# EAGLE schematic cudrone-board-mk-2 (EAGLE 8.2.2)

## Sheet 1 of 9
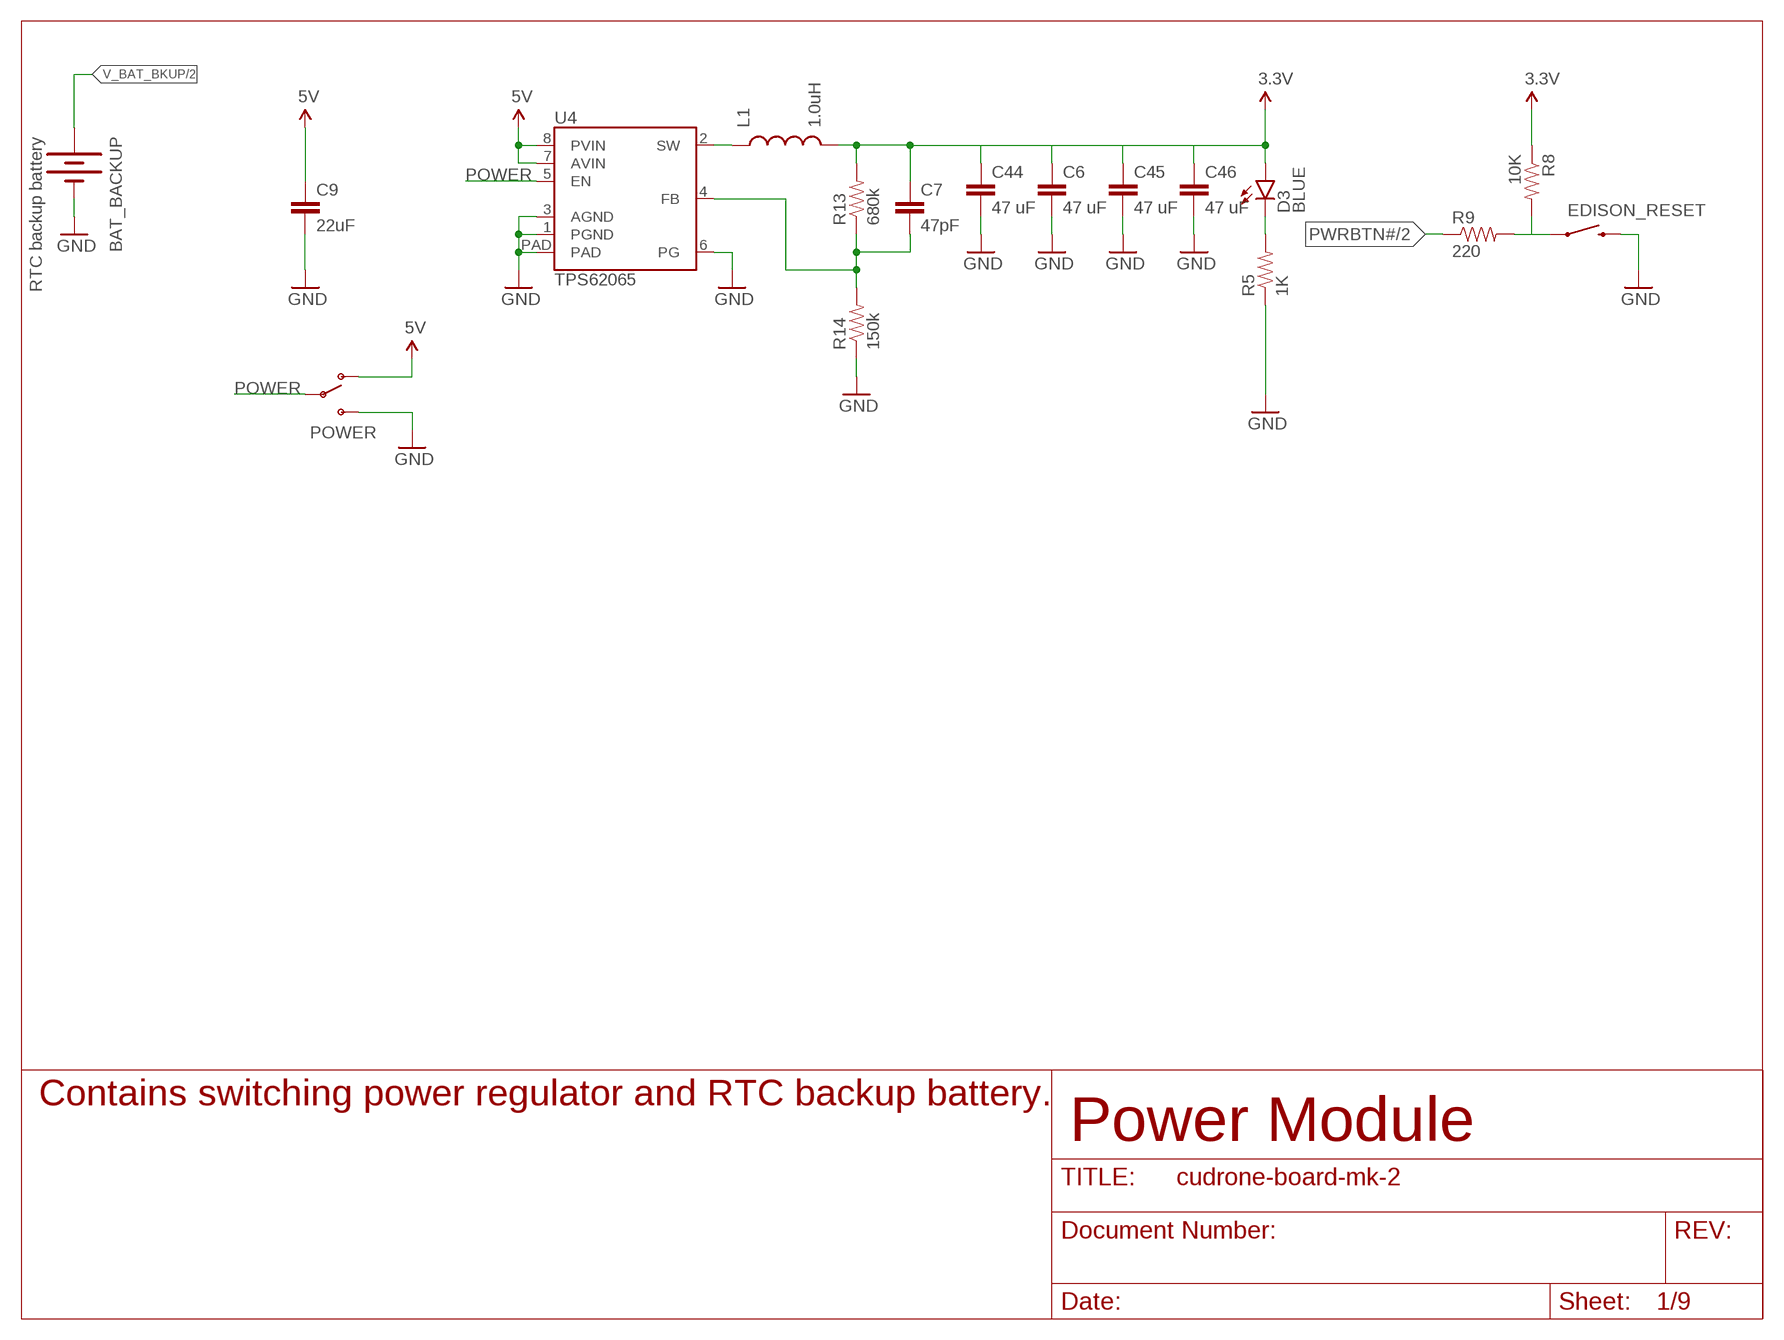
[diagram p0: schematic, sheet 1]

### Parts
BAT_BACKUP  RTC backup battery  BATTERY12MM  [BATTCON_12MM]
C6  47 uF  CAP0805  [0805]
C7  47pF  47PF-50V-5%(0603)  [0603-CAP]
C9  22uF  22UF-6.3V-20%(0805)  [0805]
C44  47 uF  CAP0805  [0805]
C45  47 uF  CAP0805  [0805]
C46  47 uF  CAP0805  [0805]
D3  BLUE  LED-BLUE0603  [LED-0603]
EDISON_RESET  SWITCH-MOMENTARY-2  [EVQPSC02K]
L1  1.0uH  INDUCTOR  [INDUCTOR-SRP4020]
POWER  CANSAT_SWITCH  [JS102011SAQN-SPDT]
R5  1K  1KOHM1/10W1%(0603)  [0603-RES@1]
R8  10K  10KOHM1/10W1%(0603)0603  [0603-RES@1]
R9  220  22OHM1/10W1%(0603)  [0603-RES@1]
R13  680k  RESISTOR0603  [0603-RES]
R14  150k  RESISTOR0603  [0603-RES]
U4  TPS62065  [WSON-8-PAD]

### Nets
3.3V: C6.1 C7.1 C44.1 C45.1 C46.1 D3.A L1.P$2 R8.1 R13.2 ; also sheet 2,4,5,6,7,8
5V: C9.1 POWER.P$1(O) U4.7(AVIN) U4.8(PVIN) ; also sheet 3,4,6,9
GND: BAT_BACKUP.GND(-) C6.2 C9.2 C44.2 C45.2 C46.2 EDISON_RESET.B EDISON_RESET.B' POWER.P$3(S) R5.1 R14.1 U4.1(PGND) U4.3(AGND) U4.6(PG) U4.PAD ; also sheet 2,3,4,5,6,7,8,9
N$12: D3.C R5.2
N$15: EDISON_RESET.A EDISON_RESET.A' R8.2 R9.2
N$17: C7.2 R13.1 R14.2 U4.4(FB)
N$19: L1.P$1 U4.2(SW)
POWER: POWER.P$C(P) U4.5(EN)
PWRBTN#: R9.1 ; also sheet 2
V_BAT_BKUP: BAT_BACKUP.PWR@1(+) ; also sheet 2

### Notes on the sheet
- Contains switching power regulator and RTC backup battery.
- Power Module

## Sheet 2 of 9
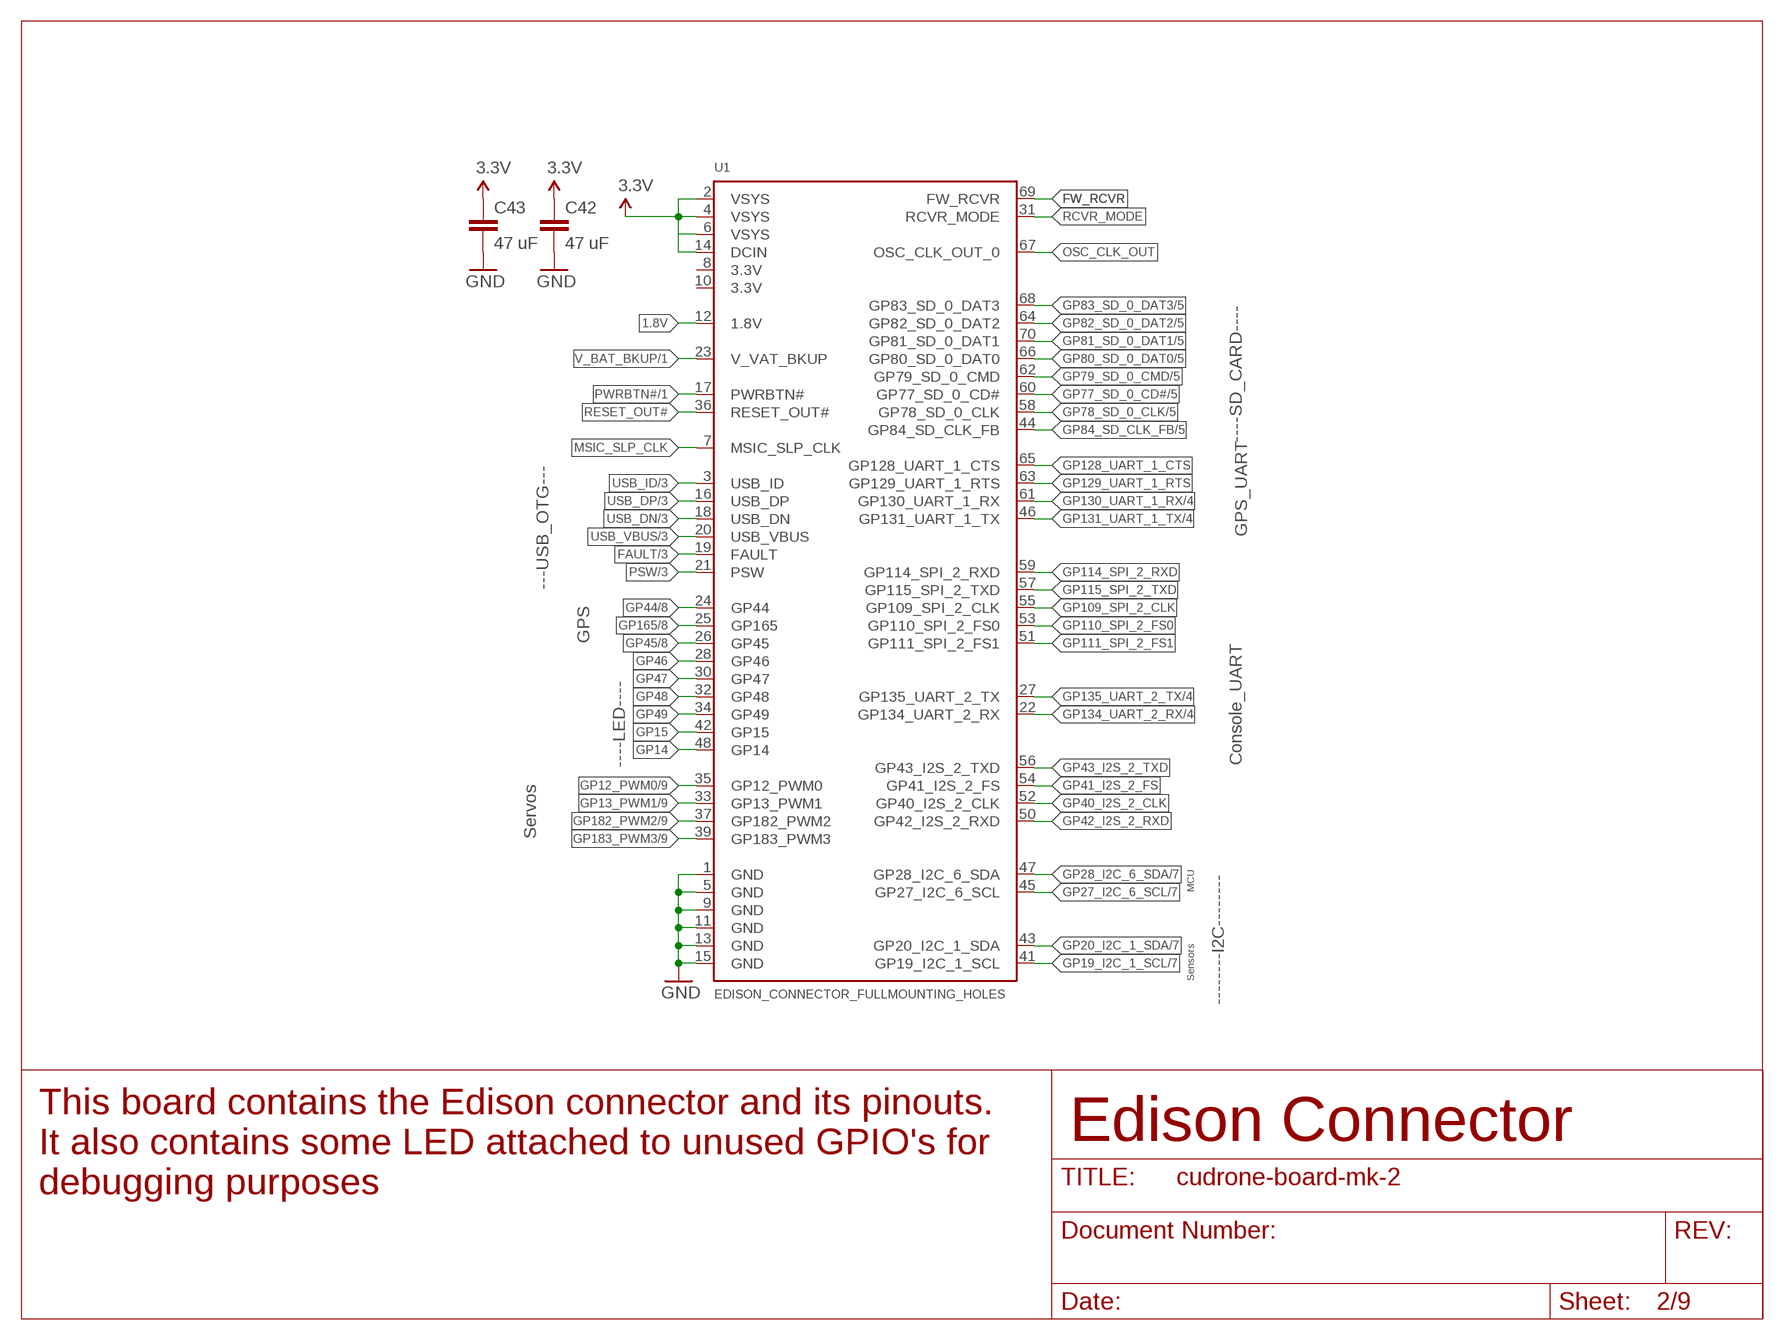
[diagram p1: schematic, sheet 2]

### Parts
C42  47 uF  CAP0805  [0805]
C43  47 uF  CAP0805  [0805]
U1  EDISON_CONNECTOR_FULLMOUNTING_HOLES  [EDISON_DAUGHTER]

### Nets
1.8V: U1.12(1.8V) ; also sheet 3,4,5,7,8,9
3.3V: C42.1 C43.1 U1.2(VSYS) U1.4(VSYS) U1.6(VSYS) U1.14(DCIN) ; also sheet 1,4,5,6,7,8
FAULT: U1.19(FAULT) ; also sheet 3
FW_RCVR: U1.69(FW_RCVR)
GND: C42.2 C43.2 U1.1(GND) U1.5(GND) U1.9(GND) U1.11(GND) U1.13(GND) U1.15(GND) ; also sheet 1,3,4,5,6,7,8,9
GP12_PWM0: U1.35(GP12_PWM0) ; also sheet 9
GP13_PWM1: U1.33(GP13_PWM1) ; also sheet 9
GP14: U1.48(GP14)
GP15: U1.42(GP15)
GP19_I2C_1_SCL: U1.41(GP19_I2C_1_SCL) ; also sheet 7
GP20_I2C_1_SDA: U1.43(GP20_I2C_1_SDA) ; also sheet 7
GP27_I2C_6_SCL: U1.45(GP27_I2C_6_SCL) ; also sheet 7
GP28_I2C_6_SDA: U1.47(GP28_I2C_6_SDA) ; also sheet 7
GP40_I2S_2_CLK: U1.52(GP40_I2S_2_CLK)
GP41_I2S_2_FS: U1.54(GP41_I2S_2_FS)
GP42_I2S_2_RXD: U1.50(GP42_I2S_2_RXD)
GP43_I2S_2_TXD: U1.56(GP43_I2S_2_TXD)
GP44: U1.24(GP44) ; also sheet 8
GP45: U1.26(GP45) ; also sheet 8
GP46: U1.28(GP46)
GP47: U1.30(GP47)
GP48: U1.32(GP48)
GP49: U1.34(GP49)
GP77_SD_0_CD#: U1.60(GP77_SD_0_CD#) ; also sheet 5
GP78_SD_0_CLK: U1.58(GP78_SD_0_CLK) ; also sheet 5
GP79_SD_0_CMD: U1.62(GP79_SD_0_CMD) ; also sheet 5
GP80_SD_0_DAT0: U1.66(GP80_SD_0_DAT0) ; also sheet 5
GP81_SD_0_DAT1: U1.70(GP81_SD_0_DAT1) ; also sheet 5
GP82_SD_0_DAT2: U1.64(GP82_SD_0_DAT2) ; also sheet 5
GP83_SD_0_DAT3: U1.68(GP83_SD_0_DAT3) ; also sheet 5
GP84_SD_CLK_FB: U1.44(GP84_SD_CLK_FB) ; also sheet 5
GP109_SPI_2_CLK: U1.55(GP109_SPI_2_CLK)
GP110_SPI_2_FS0: U1.53(GP110_SPI_2_FS0)
GP111_SPI_2_FS1: U1.51(GP111_SPI_2_FS1)
GP114_SPI_2_RXD: U1.59(GP114_SPI_2_RXD)
GP115_SPI_2_TXD: U1.57(GP115_SPI_2_TXD)
GP128_UART_1_CTS: U1.65(GP128_UART_1_CTS)
GP129_UART_1_RTS: U1.63(GP129_UART_1_RTS)
GP130_UART_1_RX: U1.61(GP130_UART_1_RX) ; also sheet 4
GP131_UART_1_TX: U1.46(GP131_UART_1_TX) ; also sheet 4
GP134_UART_2_RX: U1.22(GP134_UART_2_RX) ; also sheet 4
GP135_UART_2_TX: U1.27(GP135_UART_2_TX) ; also sheet 4
GP165: U1.25(GP165) ; also sheet 8
GP182_PWM2: U1.37(GP182_PWM2) ; also sheet 9
GP183_PWM3: U1.39(GP183_PWM3) ; also sheet 9
MSIC_SLP_CLK: U1.7(MSIC_SLP_CLK)
OSC_CLK_OUT: U1.67(OSC_CLK_OUT_0)
PSW: U1.21(PSW) ; also sheet 3
PWRBTN#: U1.17(PWRBTN#) ; also sheet 1
RCVR_MODE: U1.31(RCVR_MODE)
RESET_OUT#: U1.36(RESET_OUT#)
USB_DN: U1.18(USB_DN) ; also sheet 3
USB_DP: U1.16(USB_DP) ; also sheet 3
USB_ID: U1.3(USB_ID) ; also sheet 3
USB_VBUS: U1.20(USB_VBUS) ; also sheet 3
V_BAT_BKUP: U1.23(V_VAT_BKUP) ; also sheet 1
Unconnected: U1.8(3.3V) U1.10(3.3V)

### Notes on the sheet
- ----SD_CARD----
- ---USB_OTG---
- GPS_UART
- GPS | Console_UART
- ----LED----
- Servos
- --------I2C--------
- MCU
- Sensors
- Edison Connector
- This board contains the Edison connector and its pinouts.
  It also contains some LED attached to unused GPIO's for
  debugging purposes

## Sheet 3 of 9
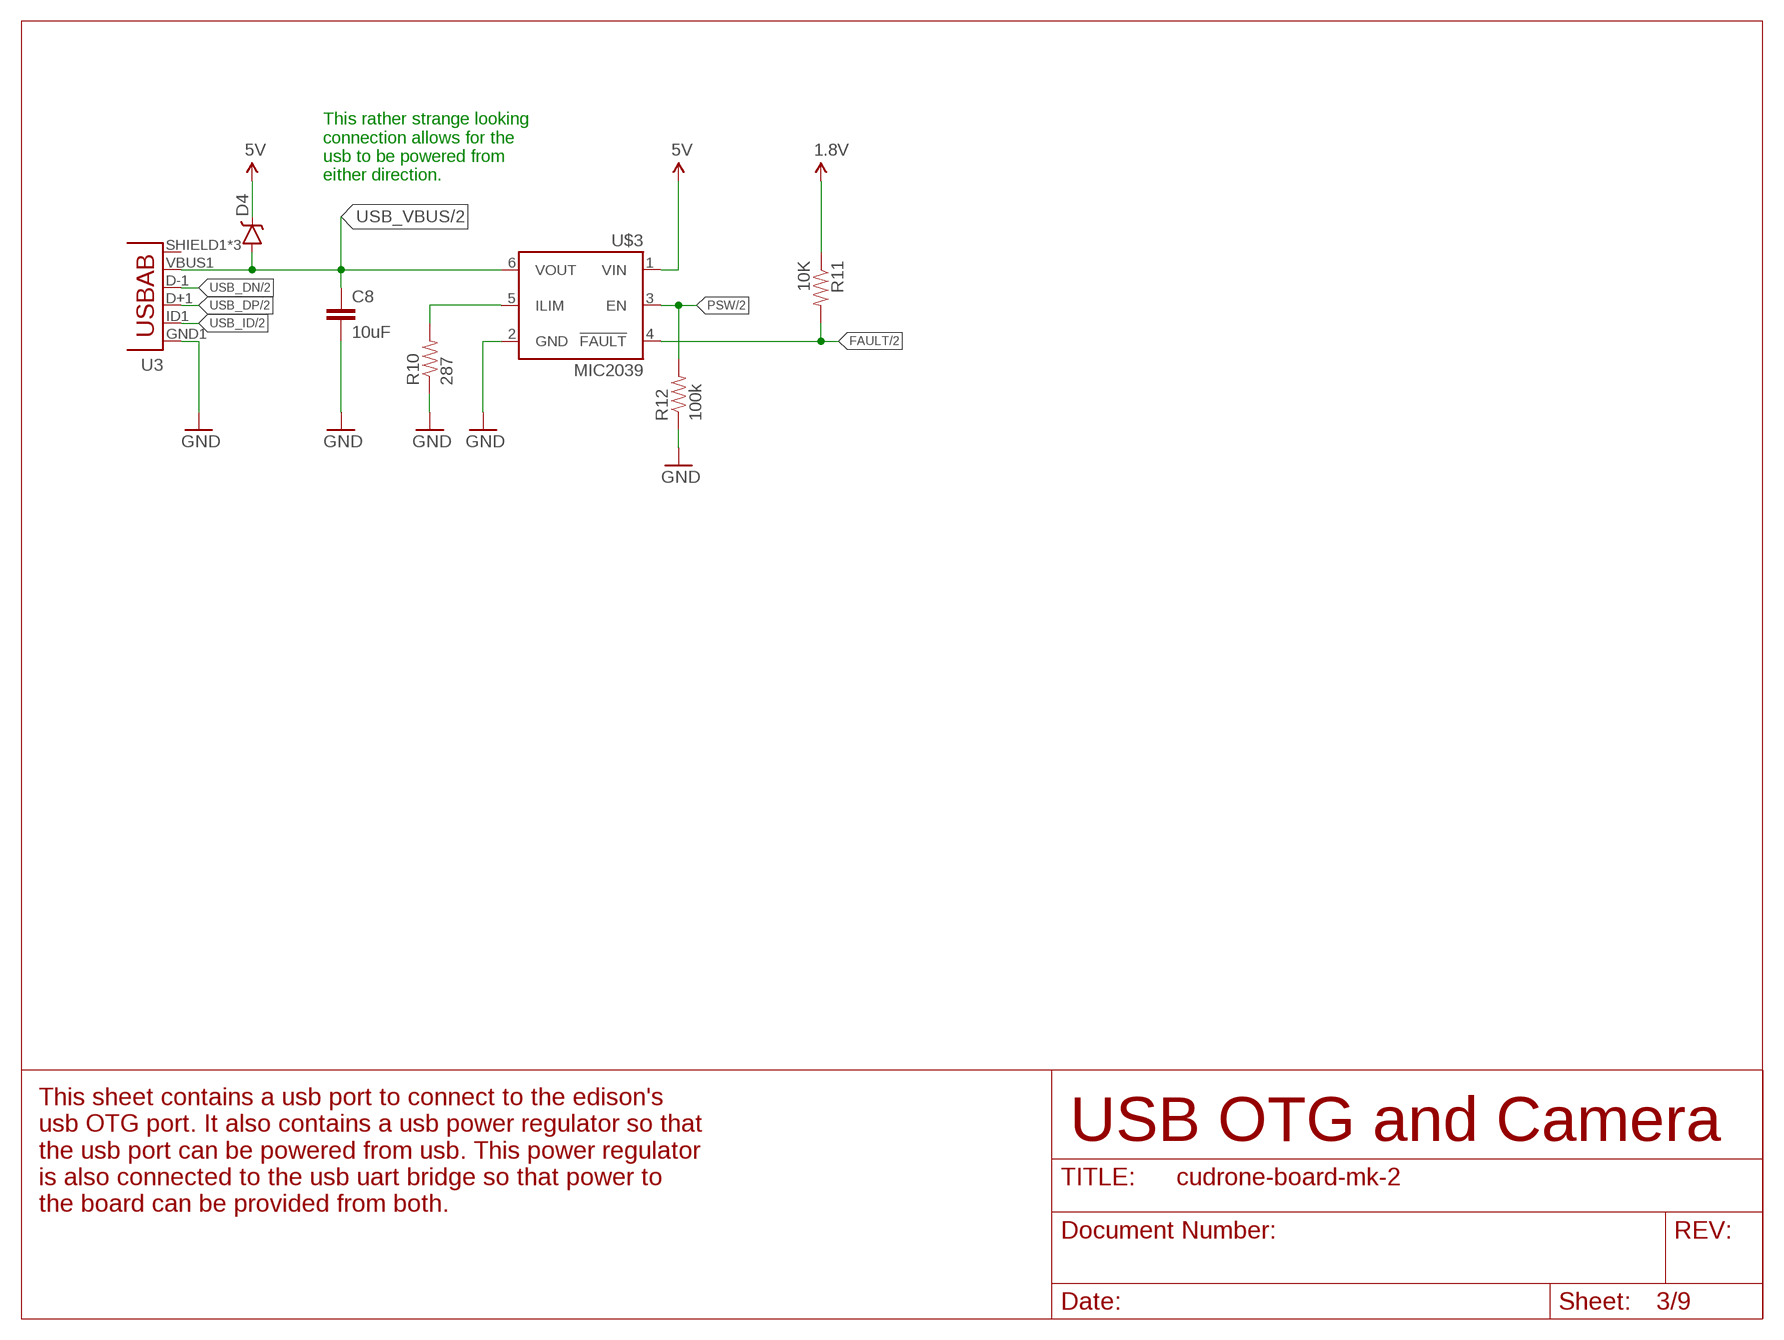
[diagram p2: schematic, sheet 3]

### Parts
C8  10uF  10UF-6.3V-20%(1206)  [1206]
D4  DIODE-SCHOTTKY-MBRA140  [SMA-DIODE]
R10  287  287OHM-1/10W-1%(0603)  [0603-RES@1]
R11  10K  10KOHM1/10W1%(0603)0603  [0603-RES@1]
R12  100k  100KOHM1/10W1%(0603)  [0603-RES@1]
U3  USB-ABCONN-11794  [USB-AB-MICRO-SMD_V03]
U$3  MIC2039  [SOT23-6]

### Nets
1.8V: R11.1 ; also sheet 2,4,5,7,8,9
5V: D4.C U$3.1(VIN) ; also sheet 1,4,6,9
FAULT: R11.2 U$3.4(!FAULT) ; also sheet 2
GND: C8.2 R10.1 R12.1 U3.GND1(GND) U$3.2(GND) ; also sheet 1,2,4,5,6,7,8,9
N$16: R10.2 U$3.5(ILIM)
PSW: R12.2 U$3.3(EN) ; also sheet 2
USB_DN: U3.D-1(D-) ; also sheet 2
USB_DP: U3.D+1(D+) ; also sheet 2
USB_ID: U3.ID1(USBID) ; also sheet 2
USB_VBUS: C8.1 D4.A U3.VBUS1(VBUS) U$3.6(VOUT) ; also sheet 2
Unconnected: U3.SHIELD1(SHIELD) U3.SHIELD2(SHIELD) U3.SHIELD3(SHIELD)

### Notes on the sheet
- This rather strange looking
  connection allows for the
  usb to be powered from
  either direction.
- USB OTG and Camera
- This sheet contains a usb port to connect to the edison's
  usb OTG port. It also contains a usb power regulator so that
  the usb port can be powered from usb. This power regulator
  is also connected to the usb uart bridge so that power to
  the board can be provided from both.

## Sheet 4 of 9
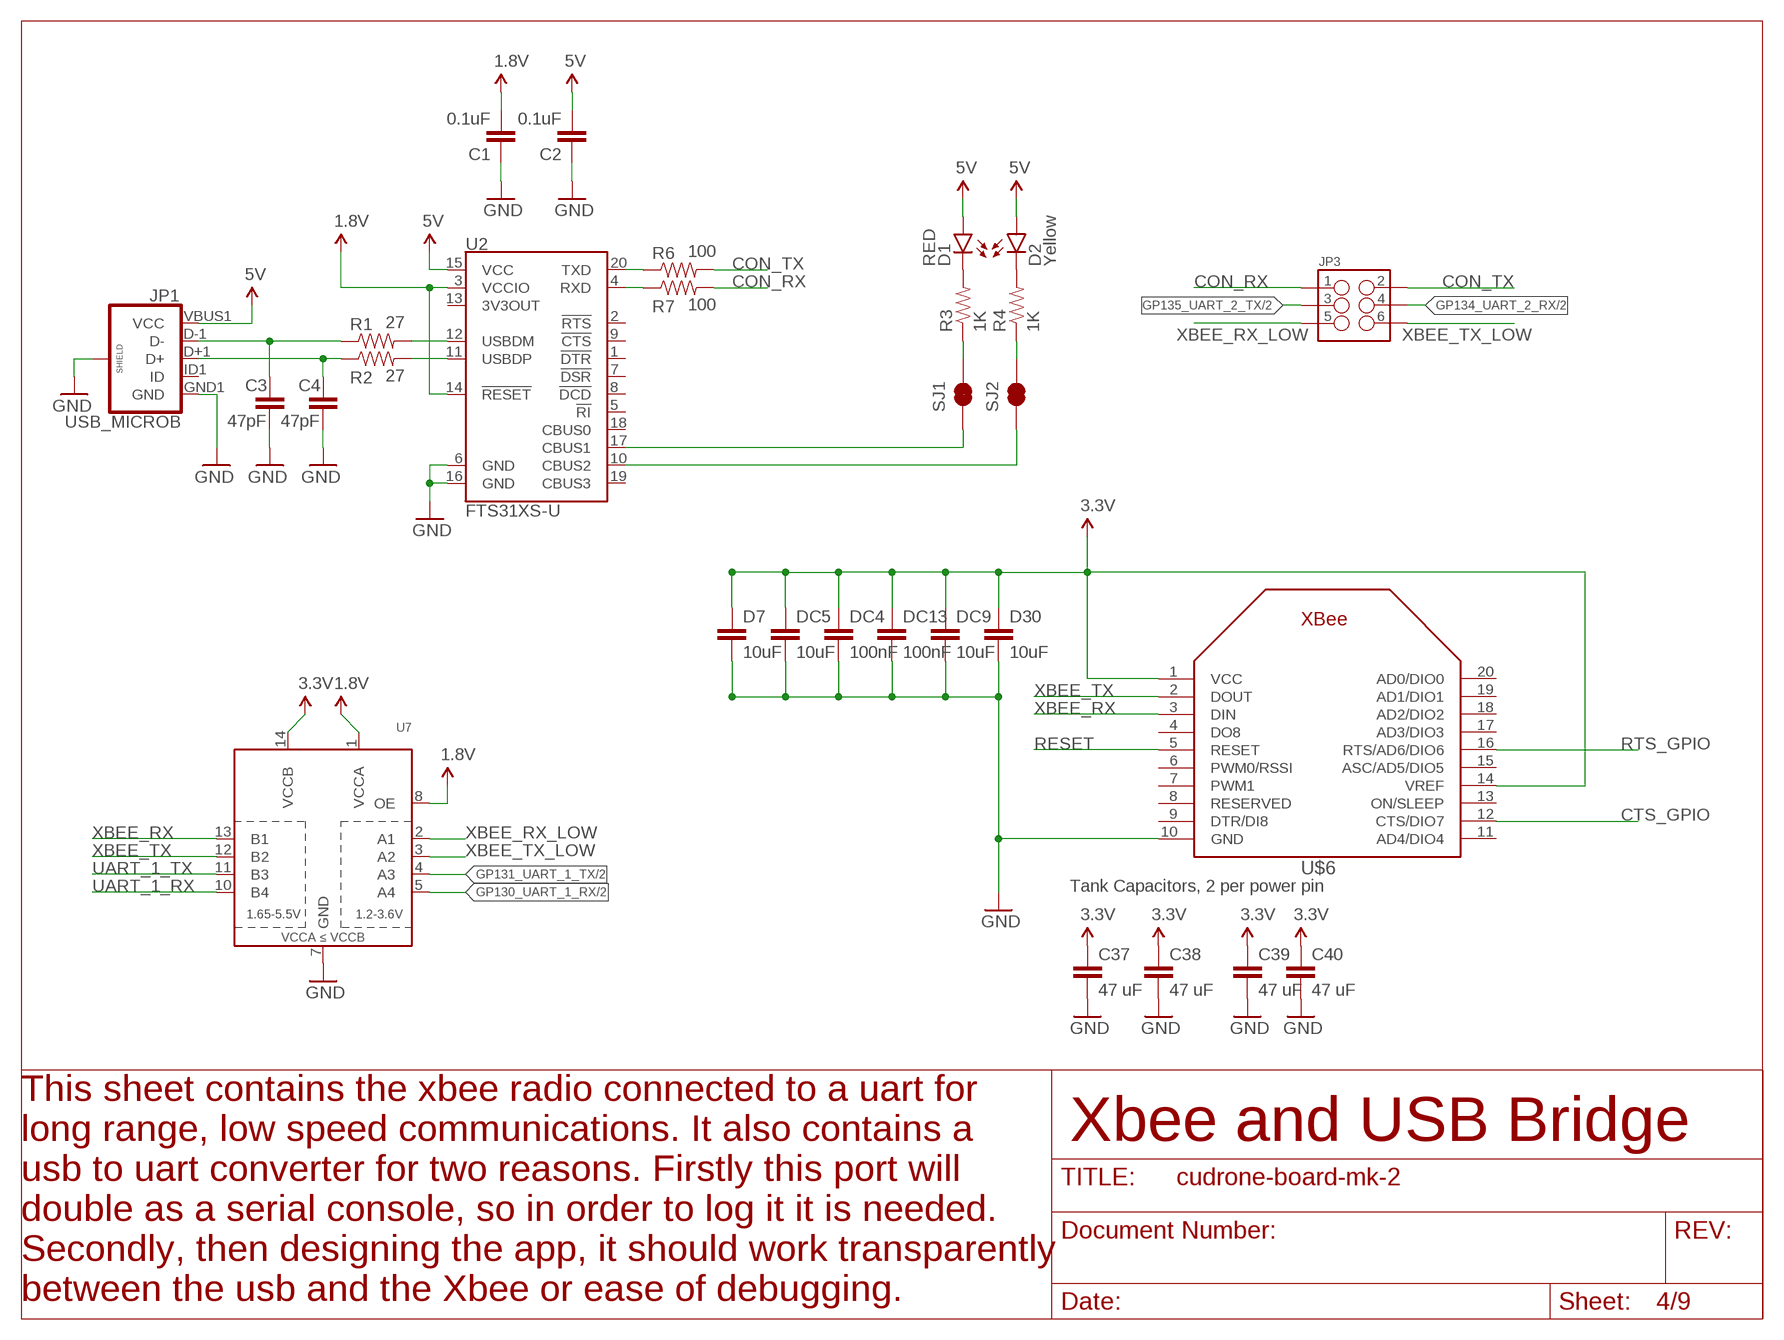
[diagram p3: schematic, sheet 4]

### Parts
C1  0.1uF  0.1UF-25V(+80/-20%)(0603)  [0603-CAP]
C2  0.1uF  0.1UF-25V(+80/-20%)(0603)  [0603-CAP]
C3  47pF  47PF-50V-5%(0603)  [0603-CAP]
C4  47pF  47PF-50V-5%(0603)  [0603-CAP]
C37  47 uF  CAP0805  [0805]
C38  47 uF  CAP0805  [0805]
C39  47 uF  CAP0805  [0805]
C40  47 uF  CAP0805  [0805]
D1  RED  LED-RED0603  [LED-0603]
D2  Yellow  LED-YELLOW0603  [LED-0603]
D7  10uF  CAP0603-CAP  [0603-CAP]
D30  10uF  CAP0603-CAP  [0603-CAP]
DC4  100nF  CAP0603-CAP  [0603-CAP]
DC5  10uF  CAP0603-CAP  [0603-CAP]
DC9  10uF  CAP0603-CAP  [0603-CAP]
DC13  100nF  CAP0603-CAP  [0603-CAP]
JP1  USB_MICROB  USB_MICROB_PLUGCONN-11752  [USB-B-MICRO-SMD_V03]
JP3  M03X2DOUBLE_JUMPER_SWAP  [2X3-DOUBLE-JUMPER-SWAP]
R1  27  27OHM1/10W1%(0603)  [0603]
R2  27  27OHM1/10W1%(0603)  [0603]
R3  1K  1KOHM1/10W1%(0603)  [0603-RES@1]
R4  1K  1KOHM1/10W1%(0603)  [0603-RES@1]
R6  100  100OHM1/10W1%(0603)  [0603-RES@1]
R7  100  100OHM1/10W1%(0603)  [0603-RES@1]
SJ1  JUMPER-PAD-2-NC_BY_TRACE  [PAD-JUMPER-2-NC_BY_TRACE_YES_SILK]
SJ2  JUMPER-PAD-2-NC_BY_TRACE  [PAD-JUMPER-2-NC_BY_TRACE_YES_SILK]
U2  FTS31XS-U  FT231XS  [SSOP20_L]
U7  TXB0104PWRSOIC14  [SO14]
U$6  XBEE  [XBEE]

### Nets
1.8V: C1.2 U2.3(VCCIO) U2.14(!RESET) U7.1(VCCA) U7.8(OE) ; also sheet 2,3,5,7,8,9
3.3V: C37.1 C38.1 C39.1 C40.1 D7.1 D30.1 DC4.1 DC5.1 DC9.1 DC13.1 U7.14(VCCB) U$6.1(VCC) U$6.14(VREF) ; also sheet 1,2,5,6,7,8
5V: C2.2 D1.A D2.A JP1.VBUS1(VCC) U2.15(VCC) ; also sheet 1,3,6,9
CON_RX: JP3.1 R7.2
CON_TX: JP3.2 R6.2
CTS_GPIO: U$6.12(CTS/DIO7)
GND: C1.1 C2.1 C3.2 C4.2 C37.2 C38.2 C39.2 C40.2 D7.2 D30.2 DC4.2 DC5.2 DC9.2 DC13.2 JP1.GND1(GND) JP1.SHIELD1(SHIELD) JP1.SHIELD2(SHIELD) JP1.SHIELD3(SHIELD) U2.6(GND) U2.16(GND) U7.7(GND) U$6.10(GND) ; also sheet 1,2,3,5,6,7,8,9
GP130_UART_1_RX: U7.5(A4) ; also sheet 2
GP131_UART_1_TX: U7.4(A3) ; also sheet 2
GP134_UART_2_RX: JP3.4 ; also sheet 2
GP135_UART_2_TX: JP3.3 ; also sheet 2
N$1: SJ1.1 U2.17(CBUS1)
N$2: C3.1 JP1.D-1(D-) R1.1
N$3: C4.1 JP1.D+1(D+) R2.1
N$4: R1.2 U2.12(USBDM)
N$5: R2.2 U2.11(USBDP)
N$6: SJ2.1 U2.10(CBUS2)
N$7: R3.1 SJ1.2
N$8: R4.1 SJ2.2
N$9: D1.C R3.2
N$10: D2.C R4.2
N$11: R6.1 U2.20(TXD)
N$14: R7.1 U2.4(RXD)
RESET [data]: U$6.5(RESET)
RTS_GPIO: U$6.16(RTS/AD6/DIO6)
UART_1_RX: U7.10(B4)
UART_1_TX: U7.11(B3) ; also sheet 8
XBEE_RX: U7.13(B1) U$6.3(DIN)
XBEE_RX_LOW: JP3.5 U7.2(A1)
XBEE_TX: U7.12(B2) U$6.2(DOUT)
XBEE_TX_LOW: JP3.6 U7.3(A2)
Unconnected: JP1.ID1(ID) U2.1(!DTR) U2.2(!RTS) U2.5(!RI) U2.7(!DSR) U2.8(!DCD) U2.9(!CTS) U2.13(3V3OUT) U2.18(CBUS0) U2.19(CBUS3) U$6.4(DO8) U$6.6(PWM0/RSSI) U$6.7(PWM1) U$6.8(RESERVED) U$6.9(DTR/DI8) U$6.11(AD4/DIO4) U$6.13(ON/SLEEP) U$6.15(ASC/AD5/DIO5) U$6.17(AD3/DIO3) U$6.18(AD2/DIO2) U$6.19(AD1/DIO1) U$6.20(AD0/DIO0)

### Notes on the sheet
- Tank Capacitors, 2 per power pin
- Xbee and USB Bridge
- This sheet contains the xbee radio connected to a uart for
  long range, low speed communications. It also contains a
  usb to uart converter for two reasons. Firstly this port will
  double as a serial console, so in order to log it it is needed.
  Secondly, then designing the app, it should work transparently
  between the usb and the Xbee or ease of debugging.

## Sheet 5 of 9
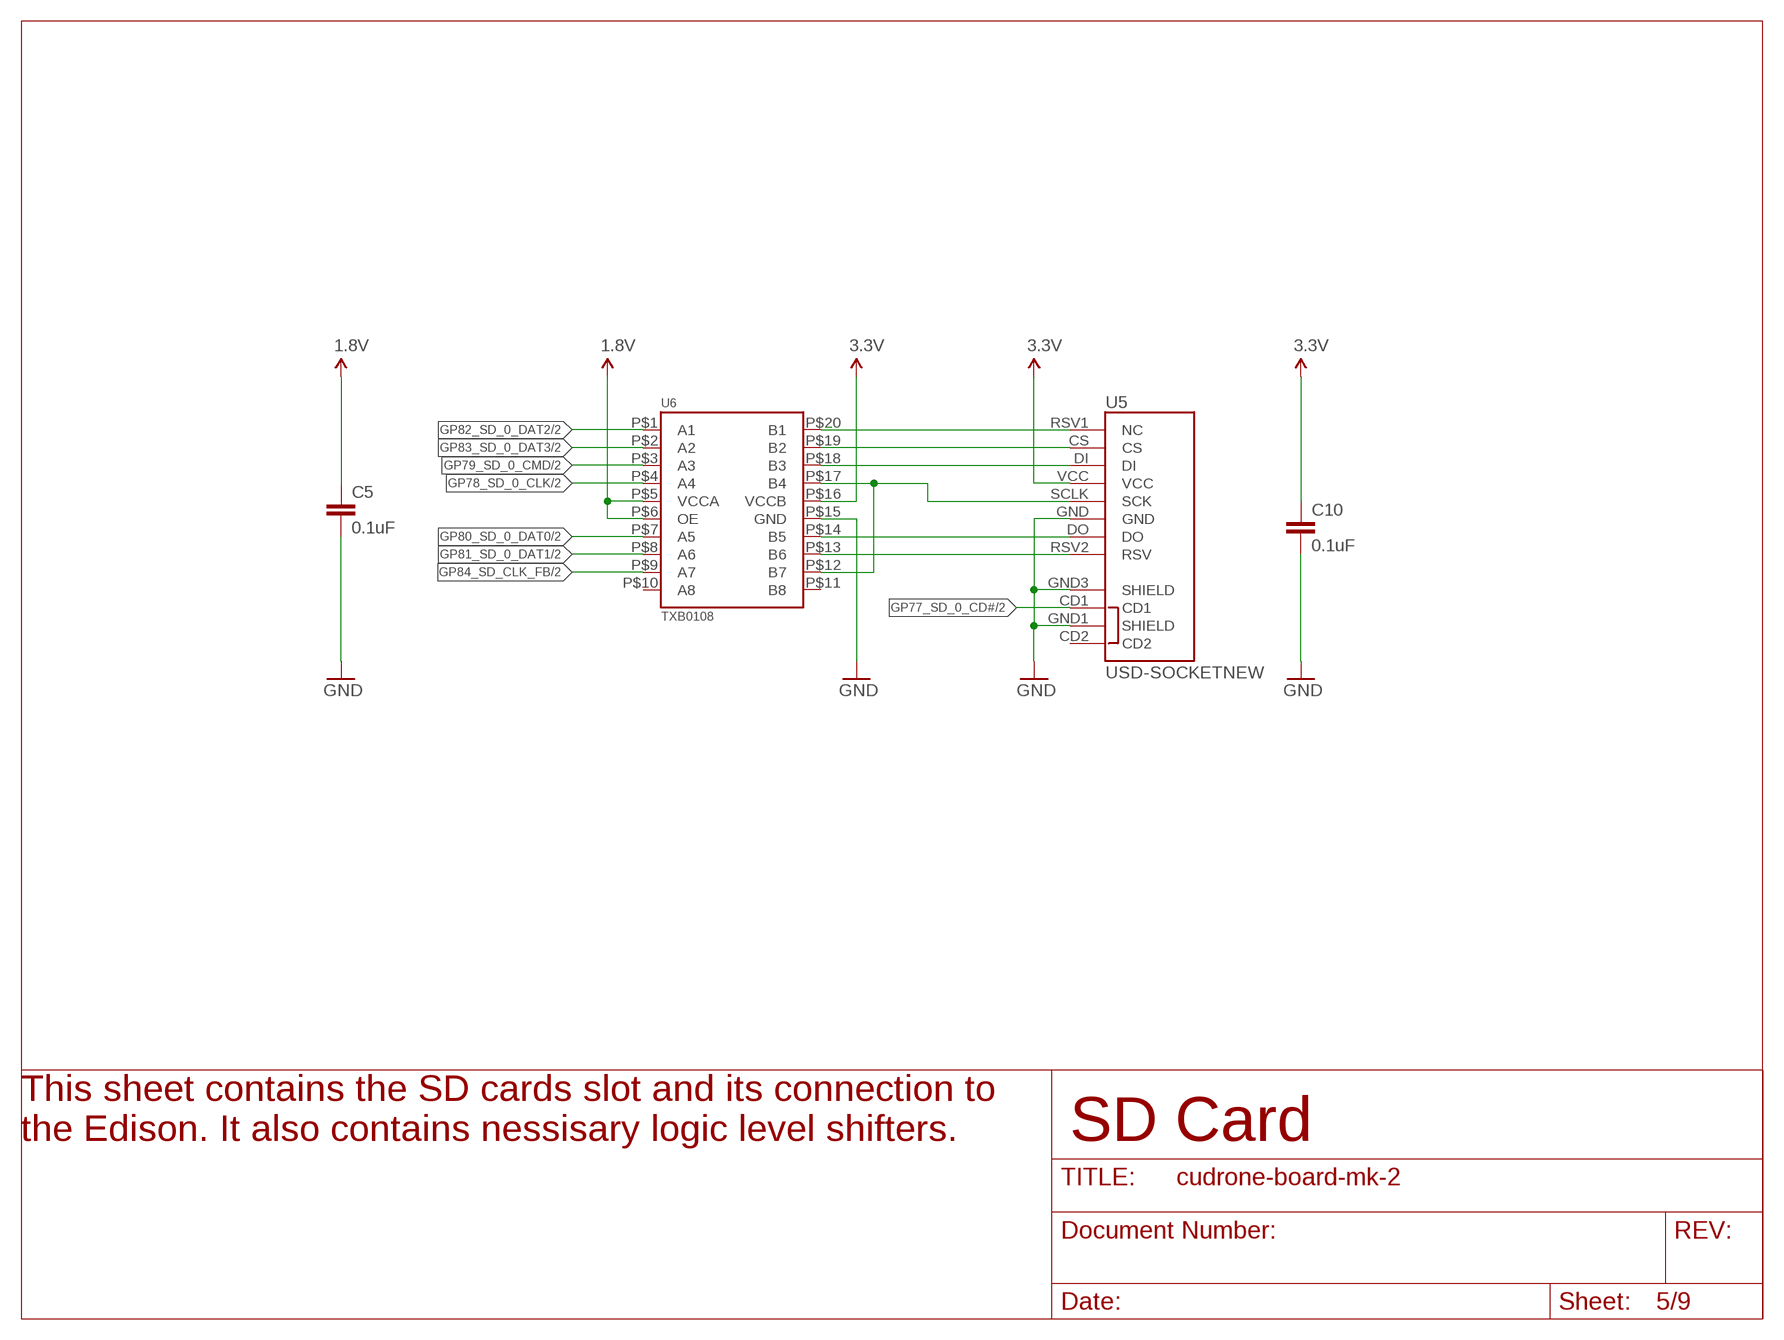
[diagram p4: schematic, sheet 5]

### Parts
C5  0.1uF  0.1UF-25V(+80/-20%)(0603)  [0603-CAP]
C10  0.1uF  0.1UF-25V(+80/-20%)(0603)  [0603-CAP]
U5  USD-SOCKETNEW  [MICRO-SD-SOCKET-PP]
U6  TXB0108  [UFDFN-20]

### Nets
1.8V: C5.1 U6.P$5(VCCA) U6.P$6(OE) ; also sheet 2,3,4,7,8,9
3.3V: C10.1 U5.VCC U6.P$16(VCCB) ; also sheet 1,2,4,6,7,8
GND: C5.2 C10.2 U5.GND U5.GND1(SHIELD) U5.GND3(SHIELD) U6.P$15(GND) ; also sheet 1,2,3,4,6,7,8,9
GP77_SD_0_CD#: U5.CD1 ; also sheet 2
GP78_SD_0_CLK: U6.P$4(A4) ; also sheet 2
GP79_SD_0_CMD: U6.P$3(A3) ; also sheet 2
GP80_SD_0_DAT0: U6.P$7(A5) ; also sheet 2
GP81_SD_0_DAT1: U6.P$8(A6) ; also sheet 2
GP82_SD_0_DAT2: U6.P$1(A1) ; also sheet 2
GP83_SD_0_DAT3: U6.P$2(A2) ; also sheet 2
GP84_SD_CLK_FB: U6.P$9(A7) ; also sheet 2
N$20: U5.RSV1(NC) U6.P$20(B1)
N$21: U5.CS U6.P$19(B2)
N$22: U5.DI U6.P$18(B3)
N$23: U5.DO U6.P$14(B5)
N$24: U5.RSV2(RSV) U6.P$13(B6)
SCK: U5.SCLK(SCK) U6.P$12(B7) U6.P$17(B4)
Unconnected: U5.CD2 U6.P$10(A8) U6.P$11(B8)

### Notes on the sheet
- This sheet contains the SD cards slot and its connection to 
  the Edison. It also contains nessisary logic level shifters.
- SD Card

## Sheet 6 of 9
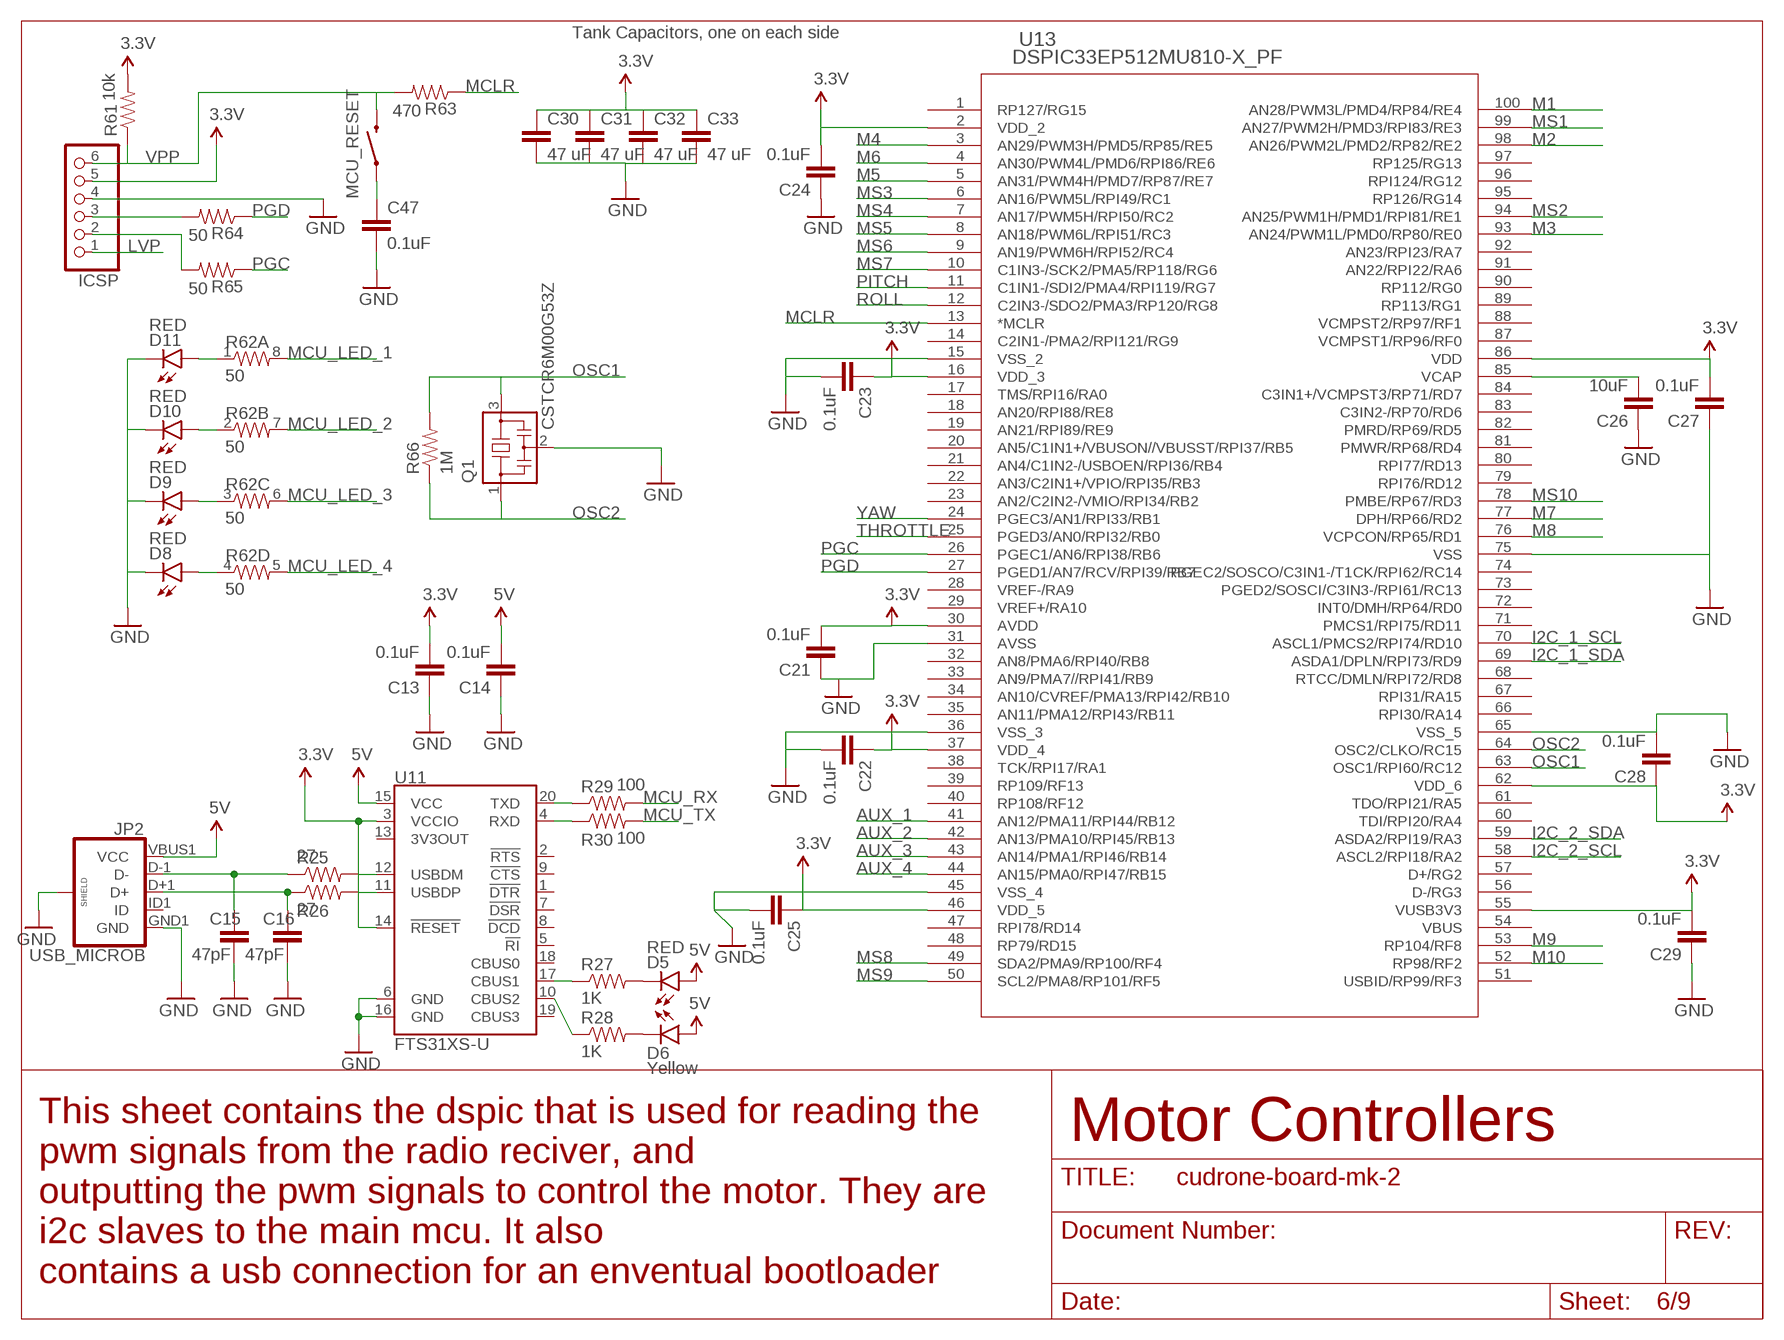
[diagram p5: schematic, sheet 6]

### Parts
C13  0.1uF  0.1UF-25V(+80/-20%)(0603)  [0603-CAP]
C14  0.1uF  0.1UF-25V(+80/-20%)(0603)  [0603-CAP]
C15  47pF  47PF-50V-5%(0603)  [0603-CAP]
C16  47pF  47PF-50V-5%(0603)  [0603-CAP]
C21  0.1uF  0.1UF-25V(+80/-20%)(0603)  [0603-CAP]
C22  0.1uF  0.1UF-25V(+80/-20%)(0603)  [0603-CAP]
C23  0.1uF  0.1UF-25V(+80/-20%)(0603)  [0603-CAP]
C24  0.1uF  0.1UF-25V(+80/-20%)(0603)  [0603-CAP]
C25  0.1uF  0.1UF-25V(+80/-20%)(0603)  [0603-CAP]
C26  10uF  0.1UF-25V(+80/-20%)(0603)  [0603-CAP]
C27  0.1uF  0.1UF-25V(+80/-20%)(0603)  [0603-CAP]
C28  0.1uF  0.1UF-25V(+80/-20%)(0603)  [0603-CAP]
C29  0.1uF  0.1UF-25V(+80/-20%)(0603)  [0603-CAP]
C30  47 uF  CAP0805  [0805]
C31  47 uF  CAP0805  [0805]
C32  47 uF  CAP0805  [0805]
C33  47 uF  CAP0805  [0805]
C47  0.1uF  0.1UF-25V(+80/-20%)(0603)  [0603-CAP]
D5  RED  LED-RED0603  [LED-0603]
D6  Yellow  LED-YELLOW0603  [LED-0603]
D8  RED  LED-RED0603  [LED-0603]
D9  RED  LED-RED0603  [LED-0603]
D10  RED  LED-RED0603  [LED-0603]
D11  RED  LED-RED0603  [LED-0603]
ICSP  PINHD-1X6/90  [1X06/90]
JP2  USB_MICROB  USB_MICROB_PLUGCONN-11752  [USB-B-MICRO-SMD_V03]
MCU_RESET  SWITCH-MOMENTARY-2  [EVQPSC02K]
Q1  CSTCR6M00G53Z  [CSTCR6M]
R25  27  27OHM1/10W1%(0603)  [0603]
R26  27  27OHM1/10W1%(0603)  [0603]
R27  1K  1KOHM1/10W1%(0603)  [0603-RES@1]
R28  1K  1KOHM1/10W1%(0603)  [0603-RES@1]
R29  100  100OHM1/10W1%(0603)  [0603-RES@1]
R30  100  100OHM1/10W1%(0603)  [0603-RES@1]
R61  10k  27OHM1/10W1%(0603)  [0603]
R62  50  RESISTOR-ARRAY0603-ARV  [0603-ARV]
R63  470  27OHM1/10W1%(0603)  [0603]
R64  50  27OHM1/10W1%(0603)  [0603]
R65  50  27OHM1/10W1%(0603)  [0603]
R66  1M  27OHM1/10W1%(0603)  [0603]
U11  FTS31XS-U  FT231XS  [SSOP20_L]
U13  DSPIC33EP512MU810-X_PF  [TQFP100_14X14MC]

### Nets
3.3V: C13.2 C21.2 C22.1 C23.1 C24.2 C25.1 C27.2 C28.1 C29.2 C30.1 C31.1 C32.1 C33.1 ICSP.5 R61.2 U11.3(VCCIO) U11.14(!RESET) U13.2(VDD_2) U13.16(VDD_3) U13.30(AVDD) U13.37(VDD_4) U13.46(VDD_5) U13.55(VUSB3V3) U13.62(VDD_6) U13.86(VDD) ; also sheet 1,2,4,5,7,8
5V: C14.2 D5.A D6.A JP2.VBUS1(VCC) U11.15(VCC) ; also sheet 1,3,4,9
AUX_1: U13.41(AN12/PMA11/RPI44/RB12) ; also sheet 9
AUX_2: U13.42(AN13/PMA10/RPI45/RB13) ; also sheet 9
AUX_3: U13.43(AN14/PMA1/RPI46/RB14) ; also sheet 9
AUX_4: U13.44(AN15/PMA0/RPI47/RB15) ; also sheet 9
GND: C13.1 C14.1 C15.2 C16.2 C21.1 C22.2 C23.2 C24.1 C25.2 C26.1 C27.1 C28.2 C29.1 C30.2 C31.2 C32.2 C33.2 C47.2 D8.C D9.C D10.C D11.C ICSP.4 JP2.GND1(GND) JP2.SHIELD1(SHIELD) JP2.SHIELD2(SHIELD) JP2.SHIELD3(SHIELD) Q1.2 U11.6(GND) U11.16(GND) U13.15(VSS_2) U13.31(AVSS) U13.36(VSS_3) U13.45(VSS_4) U13.65(VSS_5) U13.75(VSS) ; also sheet 1,2,3,4,5,7,8,9
I2C_1_SCL: U13.70(ASCL1/PMCS2/RPI74/RD10) ; also sheet 7
I2C_1_SDA: U13.69(ASDA1/DPLN/RPI73/RD9) ; also sheet 7
I2C_2_SCL: U13.58(ASCL2/RPI18/RA2) ; also sheet 7
I2C_2_SDA: U13.59(ASDA2/RPI19/RA3) ; also sheet 7
LVP: ICSP.1
M1: U13.100(AN28/PWM3L/PMD4/RP84/RE4) ; also sheet 9
M2: U13.98(AN26/PWM2L/PMD2/RP82/RE2) ; also sheet 9
M3: U13.93(AN24/PWM1L/PMD0/RP80/RE0) ; also sheet 9
M4: U13.3(AN29/PWM3H/PMD5/RP85/RE5) ; also sheet 9
M5: U13.5(AN31/PWM4H/PMD7/RP87/RE7) ; also sheet 9
M6: U13.4(AN30/PWM4L/PMD6/RPI86/RE6) ; also sheet 9
M7: U13.77(DPH/RP66/RD2) ; also sheet 9
M8: U13.76(VCPCON/RP65/RD1) ; also sheet 9
M9: U13.53(RP104/RF8) ; also sheet 9
M10: U13.52(RP98/RF2) ; also sheet 9
MCLR: R63.1 U13.13(*MCLR)
MCU_LED_1: R62.8
MCU_LED_2: R62.7
MCU_LED_3: R62.6
MCU_LED_4: R62.5
MCU_RX: R29.2
MCU_TX: R30.2
MS1: U13.99(AN27/PWM2H/PMD3/RPI83/RE3) ; also sheet 9
MS2: U13.94(AN25/PWM1H/PMD1/RPI81/RE1) ; also sheet 9
MS3: U13.6(AN16/PWM5L/RPI49/RC1) ; also sheet 9
MS4: U13.7(AN17/PWM5H/RPI50/RC2) ; also sheet 9
MS5: U13.8(AN18/PWM6L/RPI51/RC3) ; also sheet 9
MS6: U13.9(AN19/PWM6H/RPI52/RC4) ; also sheet 9
MS7: U13.10(C1IN3-/SCK2/PMA5/RP118/RG6) ; also sheet 9
MS8: U13.49(SDA2/PMA9/RP100/RF4) ; also sheet 9
MS9: U13.50(SCL2/PMA8/RP101/RF5) ; also sheet 9
MS10: U13.78(PMBE/RP67/RD3) ; also sheet 9
N$13: D8.A R62.4
N$26: C15.1 JP2.D-1(D-) R25.1
N$27: C16.1 JP2.D+1(D+) R26.1
N$28: R25.2 U11.12(USBDM)
N$29: R26.2 U11.11(USBDP)
N$30: C26.2 U13.85(VCAP)
N$31: R28.1 U11.10(CBUS2)
N$32: R27.1 U11.17(CBUS1)
N$33: D9.A R62.3
N$34: D5.C R27.2
N$35: D6.C R28.2
N$36: R29.1 U11.20(TXD)
N$37: R30.1 U11.4(RXD)
N$43: D10.A R62.2
N$44: D11.A R62.1
N$45: C47.1 MCU_RESET.A MCU_RESET.A'
N$46: ICSP.3 R64.2
N$47: ICSP.2 R65.2
OSC1: Q1.3 R66.2 U13.63(OSC1/RPI60/RC12)
OSC2: Q1.1 R66.1 U13.64(OSC2/CLKO/RC15)
PGC: R65.1 U13.26(PGEC1/AN6/RPI38/RB6)
PGD: R64.1 U13.27(PGED1/AN7/RCV/RPI39/RB7)
PITCH: U13.11(C1IN1-/SDI2/PMA4/RPI119/RG7) ; also sheet 9
ROLL: U13.12(C2IN3-/SDO2/PMA3/RP120/RG8) ; also sheet 9
THROTTLE: U13.25(PGED3/AN0/RPI32/RB0) ; also sheet 9
VPP: ICSP.6 MCU_RESET.B MCU_RESET.B' R61.1 R63.2
YAW: U13.24(PGEC3/AN1/RPI33/RB1) ; also sheet 9
Unconnected: JP2.ID1(ID) U11.1(!DTR) U11.2(!RTS) U11.5(!RI) U11.7(!DSR) U11.8(!DCD) U11.9(!CTS) U11.13(3V3OUT) U11.18(CBUS0) U11.19(CBUS3) U13.1(RP127/RG15) U13.14(C2IN1-/PMA2/RPI121/RG9) U13.17(TMS/RPI16/RA0) U13.18(AN20/RPI88/RE8) U13.19(AN21/RPI89/RE9) U13.20(AN5/C1IN1+/VBUSON//VBUSST/RPI37/RB5) U13.21(AN4/C1IN2-/USBOEN/RPI36/RB4) U13.22(AN3/C2IN1+/VPIO/RPI35/RB3) U13.23(AN2/C2IN2-/VMIO/RPI34/RB2) U13.28(VREF-/RA9) U13.29(VREF+/RA10) U13.32(AN8/PMA6/RPI40/RB8) U13.33(AN9/PMA7//RPI41/RB9) U13.34(AN10/CVREF/PMA13/RPI42/RB10) U13.35(AN11/PMA12/RPI43/RB11) U13.38(TCK/RPI17/RA1) U13.39(RP109/RF13) U13.40(RP108/RF12) U13.47(RPI78/RD14) U13.48(RP79/RD15) U13.51(USBID/RP99/RF3) U13.56(D-/RG3) U13.57(D+/RG2) U13.60(TDI/RPI20/RA4) U13.61(TDO/RPI21/RA5) U13.66(RPI30/RA14) U13.67(RPI31/RA15) U13.68(RTCC/DMLN/RPI72/RD8) U13.71(PMCS1/RPI75/RD11) U13.72(INT0/DMH/RP64/RD0) U13.73(PGED2/SOSCI/C3IN3-/RPI61/RC13) U13.74(PGEC2/SOSCO/C3IN1-/T1CK/RPI62/RC14) U13.79(RPI76/RD12) U13.80(RPI77/RD13) U13.81(PMWR/RP68/RD4) U13.82(PMRD/RP69/RD5) U13.83(C3IN2-/RP70/RD6) U13.84(C3IN1+/VCMPST3/RP71/RD7) U13.87(VCMPST1/RP96/RF0) U13.88(VCMPST2/RP97/RF1) U13.89(RP113/RG1) U13.90(RP112/RG0) U13.91(AN22/RPI22/RA6) U13.92(AN23/RPI23/RA7) U13.95(RP126/RG14) U13.96(RPI124/RG12) U13.97(RP125/RG13)

### Notes on the sheet
- Tank Capacitors, one on each side
- Motor Controllers
- This sheet contains the dspic that is used for reading the
  pwm signals from the radio reciver, and 
  outputting the pwm signals to control the motor. They are
  i2c slaves to the main mcu. It also 
  contains a usb connection for an enventual bootloader

## Sheet 7 of 9
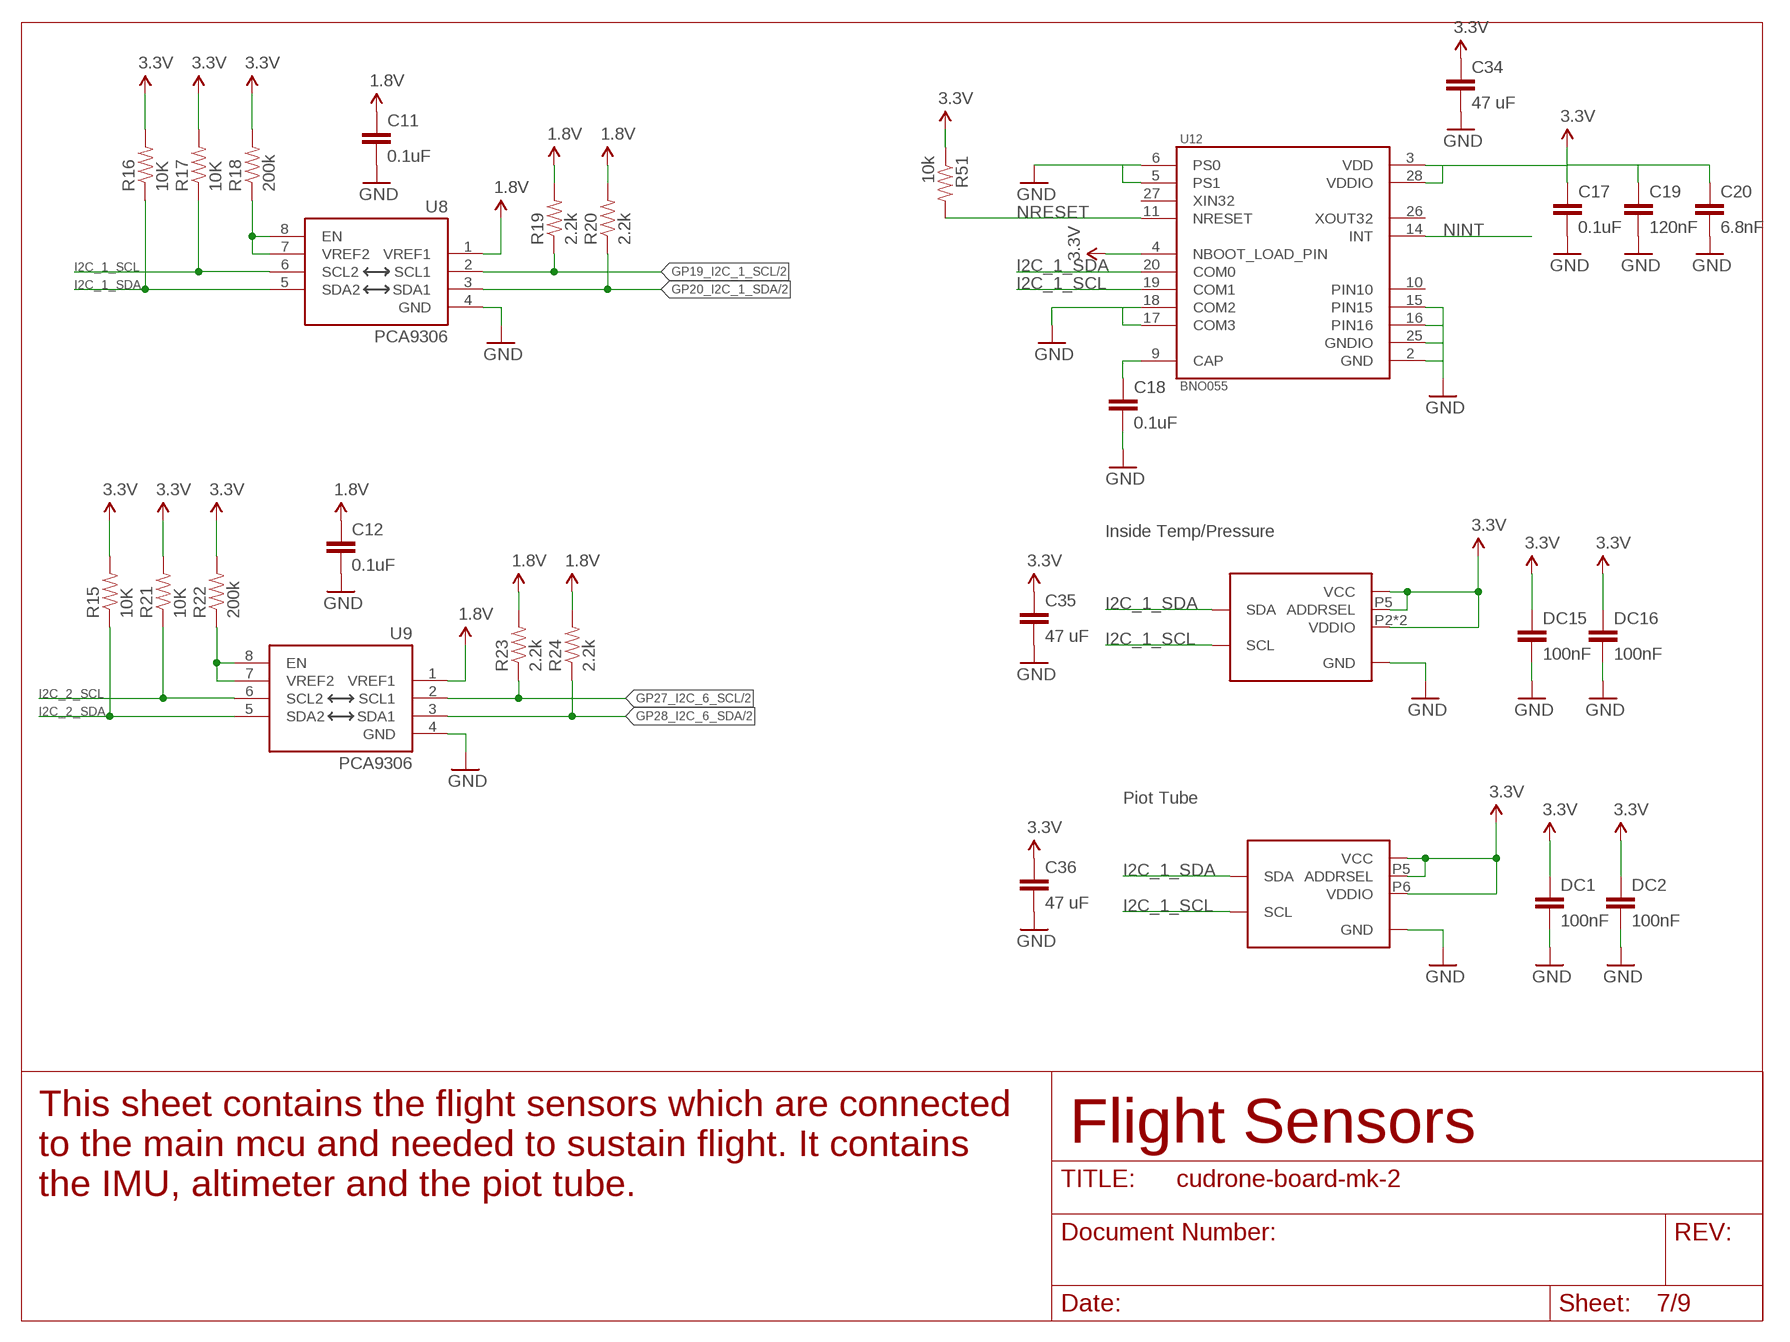
[diagram p6: schematic, sheet 7]

### Parts
C11  0.1uF  0.1UF-25V(+80/-20%)(0603)  [0603-CAP]
C12  0.1uF  0.1UF-25V(+80/-20%)(0603)  [0603-CAP]
C17  0.1uF  CAP0603-CAP  [0603-CAP]
C18  0.1uF  CAP0603-CAP  [0603-CAP]
C19  120nF  CAP0603-CAP  [0603-CAP]
C20  6.8nF  CAP0603-CAP  [0603-CAP]
C34  47 uF  CAP0805  [0805]
C35  47 uF  CAP0805  [0805]
C36  47 uF  CAP0805  [0805]
DC1  100nF  CAP0603-CAP  [0603-CAP]
DC2  100nF  CAP0603-CAP  [0603-CAP]
DC15  100nF  CAP0603-CAP  [0603-CAP]
DC16  100nF  CAP0603-CAP  [0603-CAP]
R15  10K  10KOHM1/10W1%(0603)0603  [0603-RES@1]
R16  10K  10KOHM1/10W1%(0603)0603  [0603-RES@1]
R17  10K  10KOHM1/10W1%(0603)0603  [0603-RES@1]
R18  200k  200KOHM1/10W1%(0603)200K  [0603-RES@1]
R19  2.2k  2.2KOHM1/10W1%(0603)  [0603-RES@1]
R20  2.2k  2.2KOHM1/10W1%(0603)  [0603-RES@1]
R21  10K  10KOHM1/10W1%(0603)0603  [0603-RES@1]
R22  200k  200KOHM1/10W1%(0603)200K  [0603-RES@1]
R23  2.2k  2.2KOHM1/10W1%(0603)  [0603-RES@1]
R24  2.2k  2.2KOHM1/10W1%(0603)  [0603-RES@1]
R51  10k  RESISTOR0805-RES  [0805]
U8  PCA9306  PCA9306PCA9306DC-1:1  [PCA9306DC-1:1]
U9  PCA9306  PCA9306PCA9306DC-1:1  [PCA9306DC-1:1]
U12  BNO055  [LGA28R50P4X10_380X520X100]
U$4  BMP280  [LGA-8]
U$5  BMP280PITOT  [BMP280_PITOT]

### Nets
1.8V: C11.1 C12.1 R19.2 R20.2 R23.2 R24.2 U8.1(VREF1) U9.1(VREF1) ; also sheet 2,3,4,5,8,9
3.3V: C17.1 C19.1 C20.1 C34.1 C35.1 C36.1 DC1.1 DC2.1 DC15.1 DC16.1 R15.2 R16.2 R17.2 R18.2 R21.2 R22.2 R51.1 U12.3(VDD) U12.4(NBOOT_LOAD_PIN) U12.28(VDDIO) U$4.P2(VDDIO) U$4.P5(ADDRSEL) U$4.P6(VDDIO) U$4.P8(VCC) U$5.P2(VCC) U$5.P5(ADDRSEL) U$5.P6(VDDIO) U$5.P8(VCC) ; also sheet 1,2,4,5,6,8
GND: C11.2 C12.2 C17.2 C18.2 C19.2 C20.2 C34.2 C35.2 C36.2 DC1.2 DC2.2 DC15.2 DC16.2 U8.4(GND) U9.4(GND) U12.2(GND) U12.5(PS1) U12.6(PS0) U12.15(PIN15) U12.16(PIN16) U12.17(COM3) U12.18(COM2) U12.25(GNDIO) U$4.P1(GND) U$4.P7(GND) U$5.P1(GND) U$5.P7(GND) ; also sheet 1,2,3,4,5,6,8,9
GP19_I2C_1_SCL: R19.1 U8.2(SCL1) ; also sheet 2
GP20_I2C_1_SDA: R20.1 U8.3(SDA1) ; also sheet 2
GP27_I2C_6_SCL: R23.1 U9.2(SCL1) ; also sheet 2
GP28_I2C_6_SDA: R24.1 U9.3(SDA1) ; also sheet 2
I2C_1_SCL: R17.1 U8.6(SCL2) U12.19(COM1) U$4.P4(SCL) U$5.P4(SCL) ; also sheet 6
I2C_1_SDA: R16.1 U8.5(SDA2) U12.20(COM0) U$4.P3(SDA) U$5.P3(SDA) ; also sheet 6
I2C_2_SCL: R21.1 U9.6(SCL2) ; also sheet 6
I2C_2_SDA: R15.1 U9.5(SDA2) ; also sheet 6
N$18: R22.1 U9.7(VREF2) U9.8(EN)
N$25: R18.1 U8.7(VREF2) U8.8(EN)
N$38: C18.1 U12.9(CAP)
NINT: U12.14(INT)
NRESET: R51.2 U12.11(NRESET)
Unconnected: U12.26(XOUT32) U12.27(XIN32)

### Notes on the sheet
- Inside Temp/Pressure
- Piot Tube
- Flight Sensors
- This sheet contains the flight sensors which are connected
  to the main mcu and needed to sustain flight. It contains
  the IMU, altimeter and the piot tube.

## Sheet 8 of 9
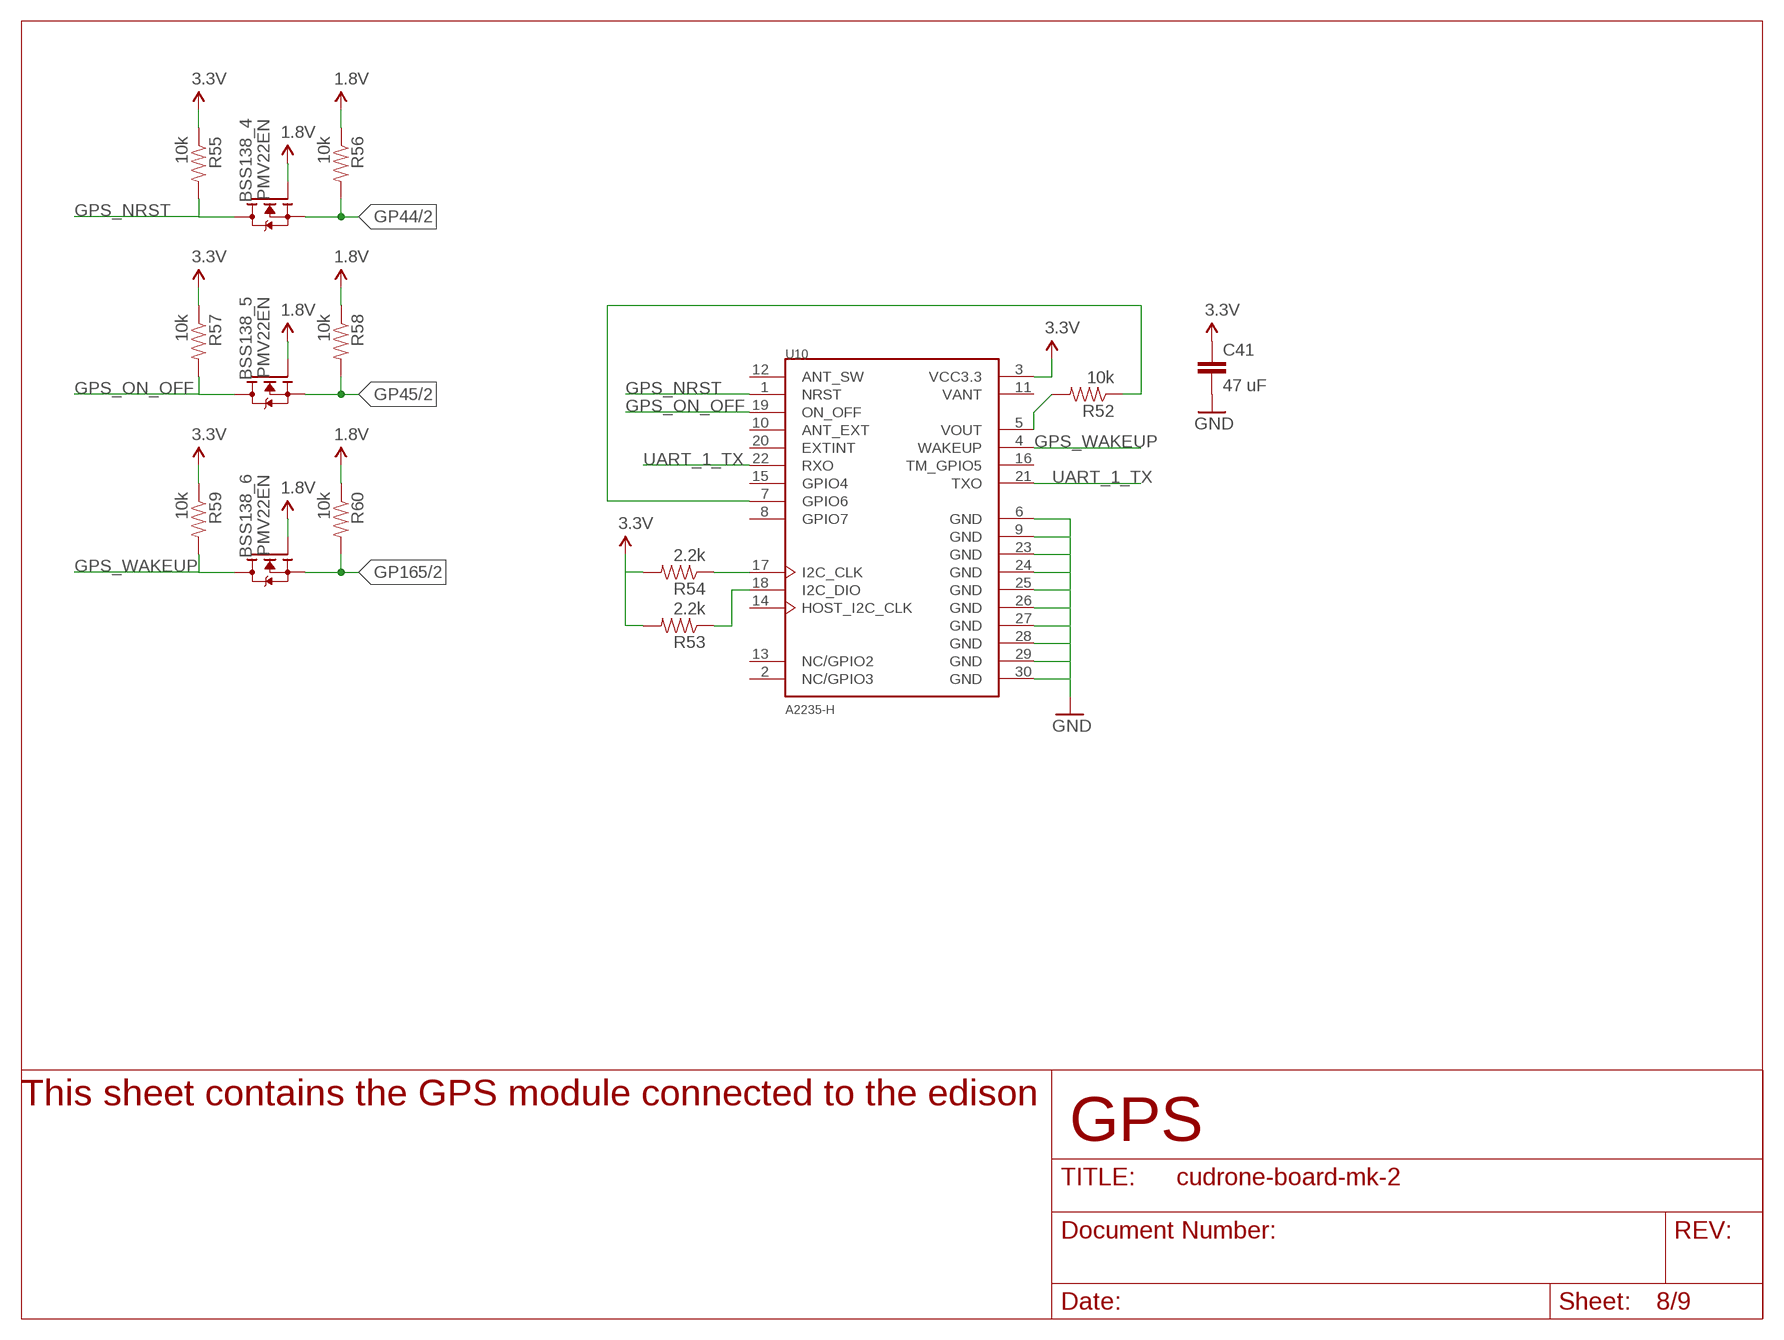
[diagram p7: schematic, sheet 8]

### Parts
BSS138_4  PMV22EN  [SOT23]
BSS138_5  PMV22EN  [SOT23]
BSS138_6  PMV22EN  [SOT23]
C41  47 uF  CAP0805  [0805]
R52  10k  200KOHM1/10W1%(0603)200K  [0603-RES@1]
R53  2.2k  2.2KOHM1/10W1%(0603)  [0603-RES@1]
R54  2.2k  2.2KOHM1/10W1%(0603)  [0603-RES@1]
R55  10k  RESISTOR0805-RES  [0805]
R56  10k  RESISTOR0805-RES  [0805]
R57  10k  RESISTOR0805-RES  [0805]
R58  10k  RESISTOR0805-RES  [0805]
R59  10k  RESISTOR0805-RES  [0805]
R60  10k  RESISTOR0805-RES  [0805]
U10  A2235-H  [XCVR_A2235-H]

### Nets
1.8V: BSS138_4.1(G) BSS138_5.1(G) BSS138_6.1(G) R56.1 R58.1 R60.1 ; also sheet 2,3,4,5,7,9
3.3V: C41.1 R53.2 R54.2 R55.1 R57.1 R59.1 U10.3(VCC3.3) ; also sheet 1,2,4,5,6,7
GND: C41.2 U10.6(GND) U10.9(GND) U10.23(GND) U10.24(GND) U10.25(GND) U10.26(GND) U10.27(GND) U10.28(GND) U10.29(GND) U10.30(GND) ; also sheet 1,2,3,4,5,6,7,9
GP44: BSS138_4.2(S) R56.2 ; also sheet 2
GP45: BSS138_5.2(S) R58.2 ; also sheet 2
GP165: BSS138_6.2(S) R60.2 ; also sheet 2
GPS_NRST: BSS138_4.3(D) R55.2 U10.1(NRST)
GPS_ON_OFF: BSS138_5.3(D) R57.2 U10.19(ON_OFF)
GPS_WAKEUP: BSS138_6.3(D) R59.2 U10.4(WAKEUP)
N$39: R52.1 U10.7(GPIO6)
N$40: R52.2 U10.5(VOUT)
N$41: R53.1 U10.18(I2C_DIO)
N$42: R54.1 U10.17(I2C_CLK)
UART_1_TX: U10.21(TXO) U10.22(RXO) ; also sheet 4
Unconnected: U10.2(NC/GPIO3) U10.8(GPIO7) U10.10(ANT_EXT) U10.12(ANT_SW) U10.13(NC/GPIO2) U10.14(HOST_I2C_CLK) U10.15(GPIO4) U10.16(TM_GPIO5) U10.20(EXTINT)

### Notes on the sheet
- This sheet contains the GPS module connected to the edison
- GPS

## Sheet 9 of 9
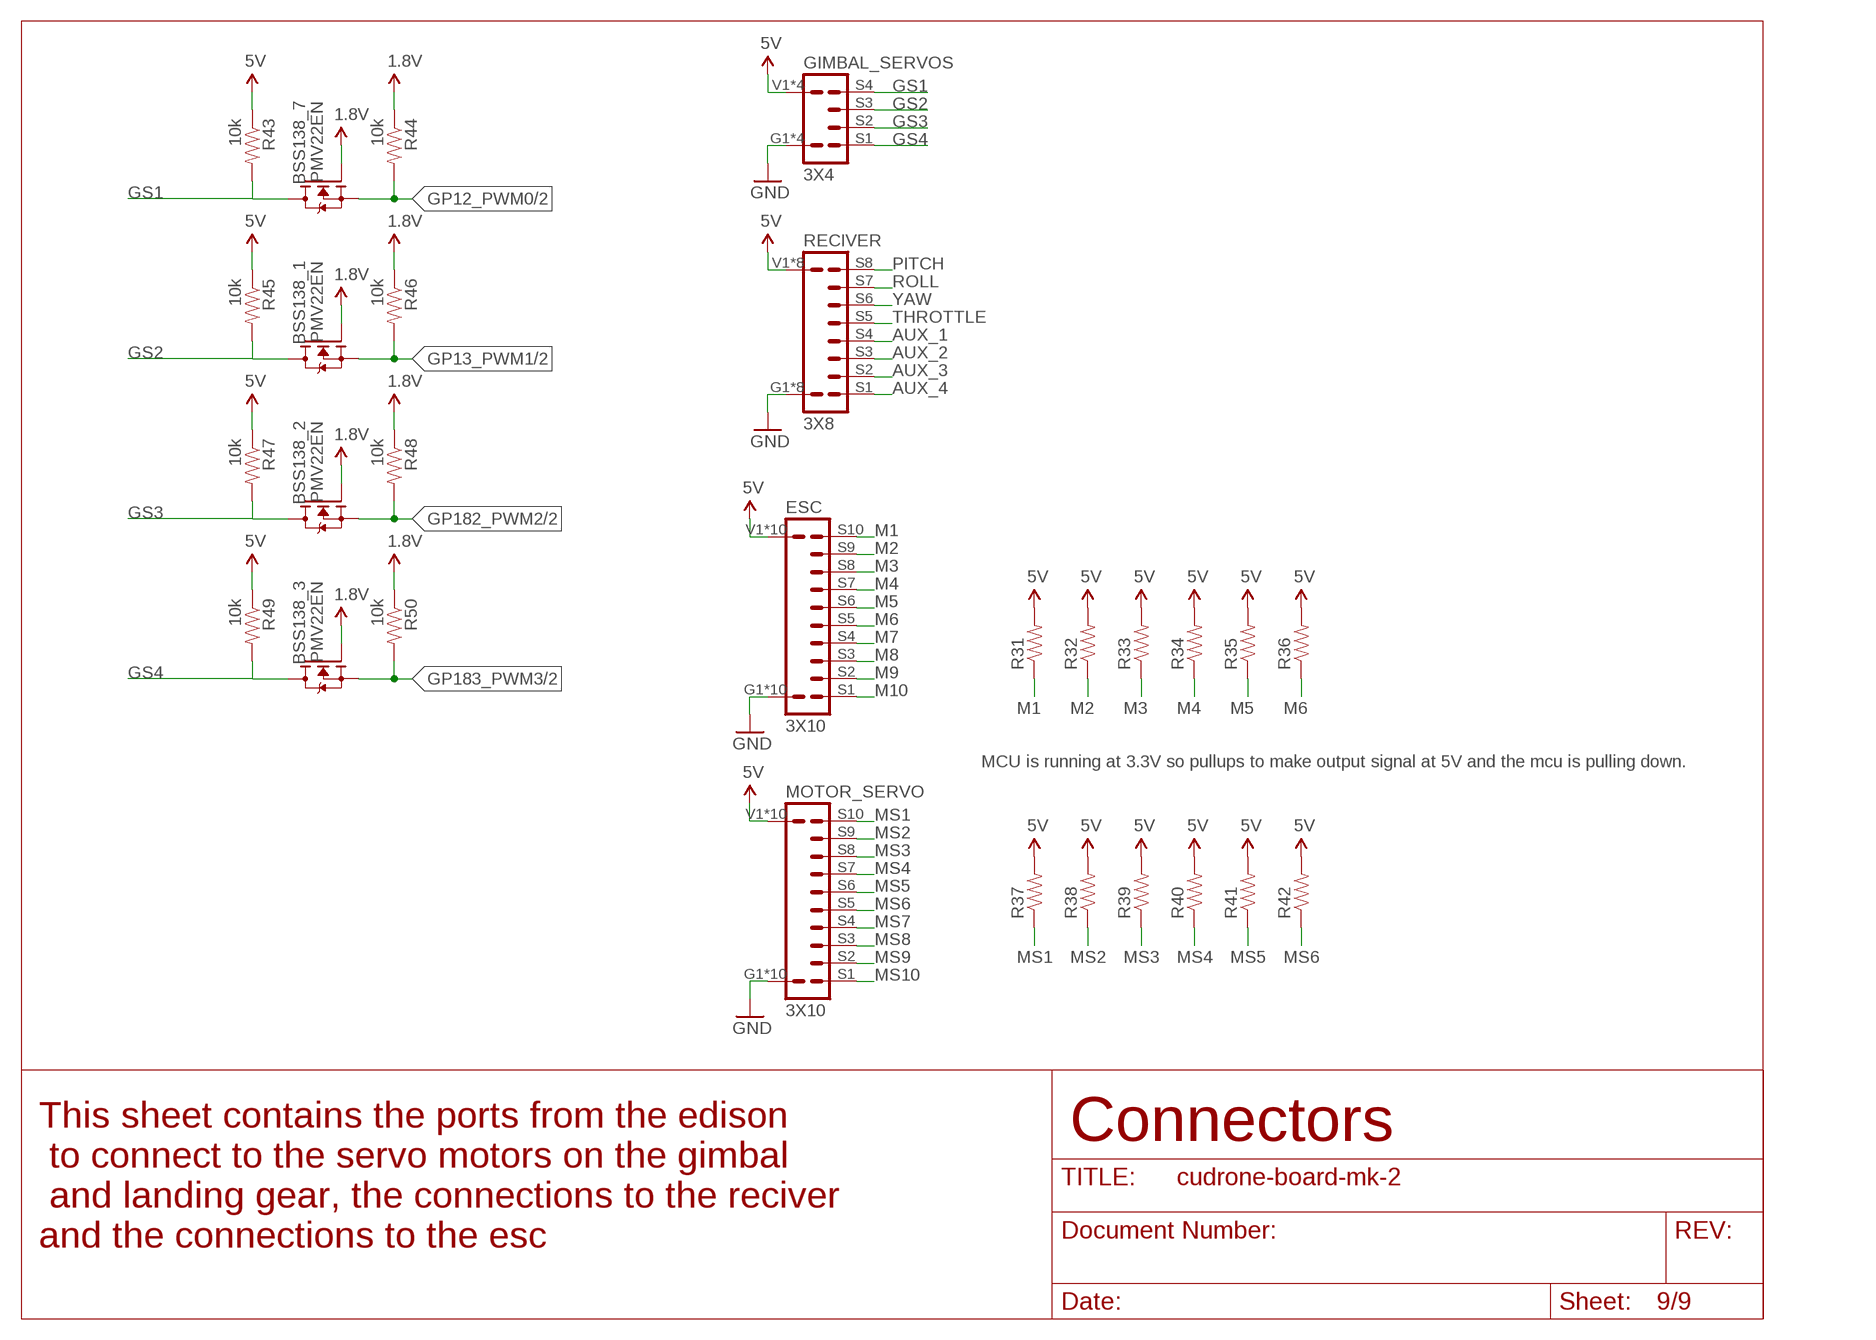
[diagram p8: schematic, sheet 9]

### Parts
BSS138_1  PMV22EN  [SOT23]
BSS138_2  PMV22EN  [SOT23]
BSS138_3  PMV22EN  [SOT23]
BSS138_7  PMV22EN  [SOT23]
ESC  3X10  [3X10]
GIMBAL_SERVOS  3X4  [3X4]
MOTOR_SERVO  3X10  [3X10]
R31  RESISTOR0603-RES  [0603-RES]
R32  RESISTOR0603-RES  [0603-RES]
R33  RESISTOR0603-RES  [0603-RES]
R34  RESISTOR0603-RES  [0603-RES]
R35  RESISTOR0603-RES  [0603-RES]
R36  RESISTOR0603-RES  [0603-RES]
R37  RESISTOR0603-RES  [0603-RES]
R38  RESISTOR0603-RES  [0603-RES]
R39  RESISTOR0603-RES  [0603-RES]
R40  RESISTOR0603-RES  [0603-RES]
R41  RESISTOR0603-RES  [0603-RES]
R42  RESISTOR0603-RES  [0603-RES]
R43  10k  RESISTOR0805-RES  [0805]
R44  10k  RESISTOR0805-RES  [0805]
R45  10k  RESISTOR0805-RES  [0805]
R46  10k  RESISTOR0805-RES  [0805]
R47  10k  RESISTOR0805-RES  [0805]
R48  10k  RESISTOR0805-RES  [0805]
R49  10k  RESISTOR0805-RES  [0805]
R50  10k  RESISTOR0805-RES  [0805]
RECIVER  3X8  [3X8]

### Nets
1.8V: BSS138_1.1(G) BSS138_2.1(G) BSS138_3.1(G) BSS138_7.1(G) R44.1 R46.1 R48.1 R50.1 ; also sheet 2,3,4,5,7,8
5V: ESC.V1(V) ESC.V2(V) ESC.V3(V) ESC.V4(V) ESC.V5(V) ESC.V6(V) ESC.V7(V) ESC.V8(V) ESC.V9(V) ESC.V10(V) GIMBAL_SERVOS.V1(V) GIMBAL_SERVOS.V2(V) GIMBAL_SERVOS.V3(V) GIMBAL_SERVOS.V4(V) MOTOR_SERVO.V1(V) MOTOR_SERVO.V2(V) MOTOR_SERVO.V3(V) MOTOR_SERVO.V4(V) MOTOR_SERVO.V5(V) MOTOR_SERVO.V6(V) MOTOR_SERVO.V7(V) MOTOR_SERVO.V8(V) MOTOR_SERVO.V9(V) MOTOR_SERVO.V10(V) R31.2 R32.2 R33.2 R34.2 R35.2 R36.2 R37.2 R38.2 R39.2 R40.2 R41.2 R42.2 R43.1 R45.1 R47.1 R49.1 RECIVER.V1(V) RECIVER.V2(V) RECIVER.V3(V) RECIVER.V4(V) RECIVER.V5(V) RECIVER.V6(V) RECIVER.V7(V) RECIVER.V8(V) ; also sheet 1,3,4,6
AUX_1: RECIVER.S4 ; also sheet 6
AUX_2: RECIVER.S3 ; also sheet 6
AUX_3: RECIVER.S2 ; also sheet 6
AUX_4: RECIVER.S1 ; also sheet 6
GND: ESC.G1(G) ESC.G2(G) ESC.G3(G) ESC.G4(G) ESC.G5(G) ESC.G6(G) ESC.G7(G) ESC.G8(G) ESC.G9(G) ESC.G10(G) GIMBAL_SERVOS.G1(G) GIMBAL_SERVOS.G2(G) GIMBAL_SERVOS.G3(G) GIMBAL_SERVOS.G4(G) MOTOR_SERVO.G1(G) MOTOR_SERVO.G2(G) MOTOR_SERVO.G3(G) MOTOR_SERVO.G4(G) MOTOR_SERVO.G5(G) MOTOR_SERVO.G6(G) MOTOR_SERVO.G7(G) MOTOR_SERVO.G8(G) MOTOR_SERVO.G9(G) MOTOR_SERVO.G10(G) RECIVER.G1(G) RECIVER.G2(G) RECIVER.G3(G) RECIVER.G4(G) RECIVER.G5(G) RECIVER.G6(G) RECIVER.G7(G) RECIVER.G8(G) ; also sheet 1,2,3,4,5,6,7,8
GP12_PWM0: BSS138_7.2(S) R44.2 ; also sheet 2
GP13_PWM1: BSS138_1.2(S) R46.2 ; also sheet 2
GP182_PWM2: BSS138_2.2(S) R48.2 ; also sheet 2
GP183_PWM3: BSS138_3.2(S) R50.2 ; also sheet 2
GS1: BSS138_7.3(D) GIMBAL_SERVOS.S4 R43.2
GS2: BSS138_1.3(D) GIMBAL_SERVOS.S3 R45.2
GS3: BSS138_2.3(D) GIMBAL_SERVOS.S2 R47.2
GS4: BSS138_3.3(D) GIMBAL_SERVOS.S1 R49.2
M1: ESC.S10 R31.1 ; also sheet 6
M2: ESC.S9 R32.1 ; also sheet 6
M3: ESC.S8 R33.1 ; also sheet 6
M4: ESC.S7 R34.1 ; also sheet 6
M5: ESC.S6 R35.1 ; also sheet 6
M6: ESC.S5 R36.1 ; also sheet 6
M7: ESC.S4 ; also sheet 6
M8: ESC.S3 ; also sheet 6
M9: ESC.S2 ; also sheet 6
M10: ESC.S1 ; also sheet 6
MS1: MOTOR_SERVO.S10 R37.1 ; also sheet 6
MS2: MOTOR_SERVO.S9 R38.1 ; also sheet 6
MS3: MOTOR_SERVO.S8 R39.1 ; also sheet 6
MS4: MOTOR_SERVO.S7 R40.1 ; also sheet 6
MS5: MOTOR_SERVO.S6 R41.1 ; also sheet 6
MS6: MOTOR_SERVO.S5 R42.1 ; also sheet 6
MS7: MOTOR_SERVO.S4 ; also sheet 6
MS8: MOTOR_SERVO.S3 ; also sheet 6
MS9: MOTOR_SERVO.S2 ; also sheet 6
MS10: MOTOR_SERVO.S1 ; also sheet 6
PITCH: RECIVER.S8 ; also sheet 6
ROLL: RECIVER.S7 ; also sheet 6
THROTTLE: RECIVER.S5 ; also sheet 6
YAW: RECIVER.S6 ; also sheet 6

### Notes on the sheet
- MCU is running at 3.3V so pullups to make output signal at 5V and the mcu is pulling down.
- Connectors
- This sheet contains the ports from the edison
   to connect to the servo motors on the gimbal
   and landing gear, the connections to the reciver 
  and the connections to the esc

## Power pins joined to a net without a drawn wire
PIN10: U12.10(PIN10)
VANT: U10.11(VANT)
VBUS: U13.54(VBUS)

## Library data of the parts
BAT_BACKUP = SparkFun-Electromechanical:BATTERY: Battery Holders Various common sizes : AA, AAA, 20mm coin cell and 12mm coin cell. 20MM_4LEGS, BATT-10373
BSS138_1-BSS138_7 = eagle-library-edeca.net-v5:PMV22EN: PMV22EN (NXP Semiconductor) 30 V, 5.2 A N-channel Trench MOSFET
C1 C2 C5 C10-C14 C21-C25 C27-C29 C47 = SparkFun-Capacitors:0.1UF-25V(+80/-20%)(0603): CAP-00810 Ceramic Standard decoupling cap; PROD_ID: CAP-00810
C3 C4 C7 C15 C16 = SparkFun-Capacitors:47PF-50V-5%(0603): CAP-08913; PROD_ID: CAP-08913
C6 C30-C46 = SparkFun-Passives:CAP: Capacitor Standard 0603 ceramic capacitor, and 0.1" leaded capacitor.
C8 = SparkFun-Capacitors:10UF-6.3V-20%(1206): CAP-10057 Ceramic; PROD_ID: CAP-10057
C9 = SparkFun-Capacitors:22UF-6.3V-20%(0805): CAP-08402 Ceramic; PROD_ID: CAP-08402
C17-C20 D7 D30 DC1 DC2 DC4 DC5 DC9 DC13 DC15 DC16 = SparkFun-Capacitors:CAP: Capacitor Standard 0603 ceramic capacitor, and 0.1" leaded capacitor.
C26 = SparkFun-Capacitors:0.1UF-25V(+80/-20%)(0603): CAP-00810 Ceramic Standard decoupling cap; PROD_ID: CAP-00810; VALUE: 0.1uF
D1 D5 D8-D11 = SparkFun-LED:LED-RED: Assorted Red LEDs LilyPad 1206- DIO-09912 1206- DIO-00809 0603- DIO-00819 "SMART" means more efficient and expensive; PROD_ID: DIO-00819
D2 D6 = SparkFun-LED:LED-YELLOW: Yellow SMD LEDs LilyPad 1206- DIO-09909 0603- DIO-09003 "SMART" means more efficient and expensive; PROD_ID: DIO-09003
D3 = SparkFun-LED:LED-BLUE: Blue LEDs for production use Various blue LEDs stocked by SparkFun production 0603 - DIO-08575 Rebel - DIO-09553 1206 - DIO-09911; PROD_ID: DIO-08575
D4 = SparkFun-DiscreteSemi:DIODE-SCHOTTKY: Schottky diodes in SFE's production catalog BAT20J 1A 23V 0.62Vf RB751 120mA 40V 0.37Vf PMEG4005EJ 0.5A 40V 0.42Vf MBRA140 1A 40V 0.5Vf B340A 3A 40V SMA; PROD_ID: DIO-08053; VALUE: MBRA140
EDISON_RESET MCU_RESET = SparkFun-Electromechanical:SWITCH-MOMENTARY-2: Various NO switches- pushbuttons, reed, etc
ESC MOTOR_SERVO = Drone_Connectors:3X10
GIMBAL_SERVOS = Drone_Connectors:3X4
ICSP = pinhead:PINHD-1X6: PIN HEADER
JP1 JP2 = SparkFun-Connectors:USB_MICROB_PLUG: USB Micro-B connectors Some male, some female. Watch your step!; PROD_ID: CONN-11752
JP3 = SparkFun-Connectors:M03X2: 2x3 .1" header. Shrouded, with keying- CONN-10681 SMT- CONN-11415 Pogo pins- HW-11044
L1 = SparkFun-Passives:INDUCTOR: Inductors Basic Inductor/Choke - 0603 and 1206. Footprints are not proven and vary greatly between part numbers. INDUCTOR POWER 3.3UH 4.0A SMD 0.197" L x 0.197" W x 0.177" H (5.00mm x 5.00mm x 4.50mm)
POWER = SparkFun-Electromechanical:CANSAT_SWITCH
Q1 = murata-filter:CSTCR: Resonator Source: murata.co.jp; MPN: CSTCR6M00G53-R0; OC_FARNELL: 1170434; OC_NEWARK: 25M8759
R1 R2 R25 R26 = SparkFun-Resistors:27OHM1/10W1%(0603): RES-09334; PROD_ID: RES-09334
R3-R5 R27 R28 = SparkFun-Resistors:1KOHM1/10W1%(0603): RES-07856; PROD_ID: RES-07856
R6 R7 R29 R30 = SparkFun-Resistors:100OHM1/10W1%(0603): RES-07863; PROD_ID: RES-07863
R8 R11 R15-R17 R21 = SparkFun-Resistors:10KOHM1/10W1%(0603): RES-00824; PROD_ID: RES-00824
R9 = SparkFun-Resistors:22OHM1/10W1%(0603): RES-08698; PROD_ID: RES-08698; VALUE: 22
R10 = SparkFun-Resistors:287OHM-1/10W-1%(0603): RES-10752; PROD_ID: RES-10752
R12 = SparkFun-Resistors:100KOHM1/10W1%(0603): RES-07828; PROD_ID: RES-07828
R13 R14 R43-R51 R55-R60 = SparkFun-Resistors:RESISTOR: Resistor Basic schematic elements and footprints for 0603, 1206, and PTH resistors.
R18 R22 = SparkFun-Resistors:200KOHM1/10W1%(0603): RES-09385; PROD_ID: RES-09385
R19 R20 R23 R24 R53 R54 = SparkFun-Resistors:2.2KOHM1/10W1%(0603): RES-08272; PROD_ID: RES-08272
R31-R42 = SparkFun-Passives:RESISTOR: Resistor Basic schematic elements and footprints for 0603, 1206, and PTH resistors.
R52 = SparkFun-Resistors:200KOHM1/10W1%(0603): RES-09385; PROD_ID: RES-09385; VALUE: 200k
R61 R63-R66 = SparkFun-Resistors:27OHM1/10W1%(0603): RES-09334; PROD_ID: RES-09334; VALUE: 27
R62 = SparkFun-Passives:RESISTOR-ARRAY: Array Chip Resistor Source: RS Component / Phycomp
RECIVER = Drone_Connectors:3X8
SJ1 SJ2 = SparkFun-Passives:JUMPER-PAD-2-NC_BY_TRACE
U1 = SparkFun-Boards:EDISON_CONNECTOR_FULL
U2 U11 = SparkFun-DigitalIC:FT231X: FTDI FT231X Full Speed USB to Full-handshake UART This USB2.0 Full Speed IC offers a compact bridge to full handshake UART interfaces. The device is a UART, capable of operating up to 3MBaud, with low power consumption (8mA). The FT231X includes the complete FT-X series feature set and enables USB to be added into a system design quickly and easily over a UART interface.; PROD_ID: IC-11524
U3 = SparkFun-Connectors:USB-AB: This is a USB AB connector that is compatible with USB OTG. i.e. this connector can serve as a host or device; PROD_ID: CONN-11794
U4 = Testing:TPS62065: Texas Instruments TPS62172 3-17V 0.5A Step-Down Converter with DCS control. Available in adjustable and fixed output voltage versions. Is packaged in an 8-pin WSON package measuring 2 × 2 mm (DSG). See a 3.3V fixed output version of this chip in action on the Electric Imp Breakout Board <https://www.sparkfun.com/products/11400>. Datasheet <http://www.ti.com/lit/gpn/tps62172>
U5 = SparkFun-Connectors:USD-SOCKET: microSD Socket Push-push type uSD socket. Schematic element and footprint production proven. Spark Fun Electronics SKU : PRT-00127. tDoc lines correctly indicate media card edge positions when inserting (unlocked, locked, depressed). NOTE: CD1 and CD2 are connected internally; PROD_ID: CONN-07820
U6 = Testing:TXB0108
U7 = SparkFun-DigitalIC:TXB0104PWR: 4-Bit Bi-Directional Level Shifter 1.2V-3.6V (VCCA) to 1.65V-5.5V (VCCB) bi-directional level shifter with auto direction sensing. Max data rate - VCCA 1.8V: 20Mbps (50ns), VCCA 3.3V: 100Mbps (10ns) Digikey: 296-21929-1-ND (TSSOP) IC-11329; PROD_ID: IC-11329
U8 U9 = SparkFun-DigitalIC:PCA9306: Bidirectional I2C level shifter. NOT compatible with all available part number pinout schemes- DOUBLE CHECK!!!; PROD_ID: IC-10023
U10 = A2235-H:A2235-H: Gps Module, Mini Outline w/ Ant
U12 = BNO055:BNO055: BNO055 9-axis Absolute Orientation Sensor ( SiP ) w/Sensors and Sensor Fusion; AVAILABILITY: Good; DESCRIPTION: BNO055 9-axis Absolute Orientation Sensor ( SiP ) w/Sensors and Sensor Fusion; MF: Bosch; MP: BNO055; PACKAGE: LGA-28 Bosch; PRICE: 9.73 USD
U13 = DSPIC33EP512MU810-IPF:DSPIC33EP512MU810-X_PF; MANUFACTURER_PART_NUMBER: dspic33ep512mu810-x_pf; VENDOR: MICROCHIP
U$3 = Testing:MIC2039
U$4 = BMP280:BMP280: A 100nF capacitor is recommended between Vdd and GND, and also between Vddio and GND. Vdd & Vddio 3.3v I2C Address: ADDR -> Vddio = 0x77, ADDR -> GND = 0x76; AVAILABILITY: Good; DESCRIPTION: BMP280 Absolute Barometric Pressure Sensor for Battery Powered Devices 2 x 2.5mm; MF: Bosch; MP: BMP280; PACKAGE: None; PRICE: 2.16 USD
U$5 = BMP280:BMP280: A 100nF capacitor is recommended between Vdd and GND, and also between Vddio and GND. Vdd & Vddio 3.3v I2C Address: ADDR -> Vddio = 0x77, ADDR -> GND = 0x76
U$6 = adafruit:XBEE

## Net classes
1 data: width 0.152 mm
2 power: width 0.508 mm, drill 0.305 mm, clearance 0.203 mm
3 power2: width 0.254 mm